# Altium project BTM_MAIN_UNIT.PrjPcb (part 1 of 3)
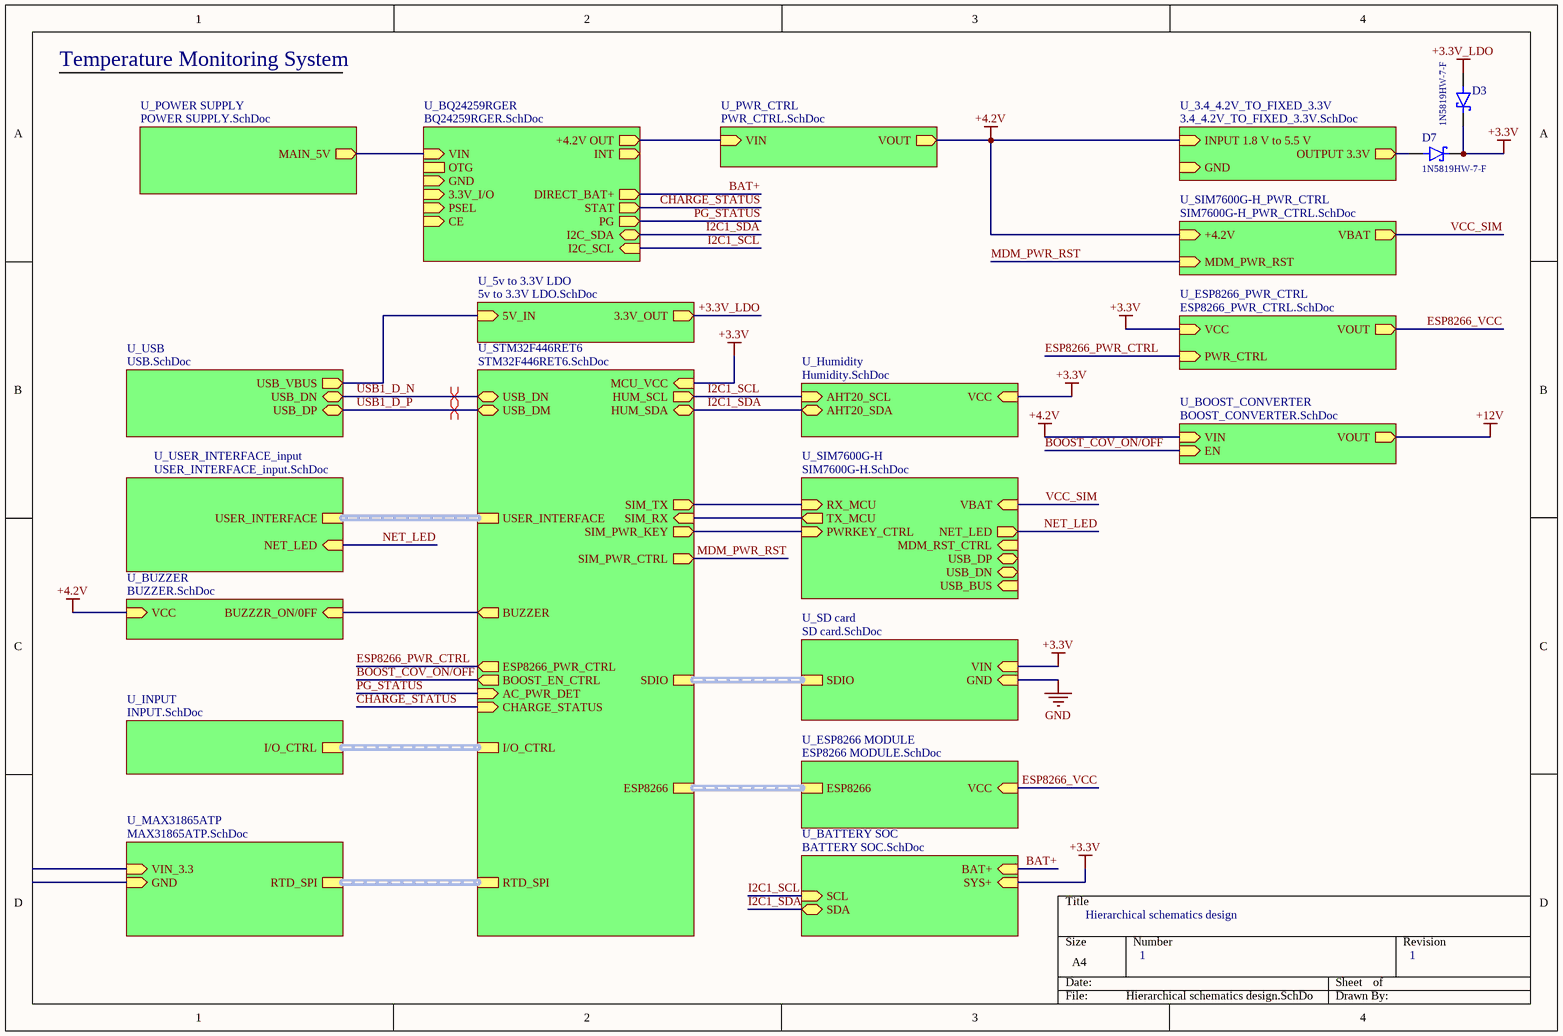
[diagram p0: Hierarchical schematics design.SchDoc]
30 sheets, 296 parts. Net scope: hierarchical (ports join the sheet entries above them; power ports are global).
Board file: PCB1.PcbDoc
Sheets:
  Hierarchical schematics design.SchDoc
    U_MAX31865ATP = MAX31865ATP.SchDoc
    U_PWR_CTRL = PWR_CTRL.SchDoc
    U_BQ24259RGER = BQ24259RGER.SchDoc
    U_SD card = SD card.SchDoc
    U_POWER SUPPLY = POWER SUPPLY.SchDoc
    U_INPUT = INPUT.SchDoc
    U_STM32F446RET6 = STM32F446RET6.SchDoc
    U_USB = USB.SchDoc
    U_3.4_4.2V_TO_FIXED_3.3V = 3.4_4.2V_TO_FIXED_3.3V.SchDoc
    U_SIM7600G-H = SIM7600G-H.SchDoc
      U_SIM_INTERFACE = SIM_INTERFACE.SchDoc
    U_BUZZER = BUZZER.SchDoc
    U_ESP8266 MODULE = ESP8266 MODULE.SchDoc
    U_Humidity = Humidity.SchDoc
    U_USER_INTERFACE_input = USER_INTERFACE_input.SchDoc
    U_SIM7600G-H_PWR_CTRL = SIM7600G-H_PWR_CTRL.SchDoc
    U_BATTERY SOC = BATTERY SOC.SchDoc
    U_ESP8266_PWR_CTRL = ESP8266_PWR_CTRL.SchDoc
    U_BOOST_CONVERTER = BOOST_CONVERTER.SchDoc
    U_5v to 3.3V LDO = 5v to 3.3V LDO.SchDoc
  FLASH MEMORY.SchDoc
  ETHERNET_W5500.SchDoc
  ETHERNET_STM32.SchDoc
  RS485.SchDoc
  OUTPUT.SchDoc
  SIM7600G-H_USB.SchDoc
  NRF52.SchDoc
  12V_TO_5V_DC.SchDoc
  Display_PWR_CTRL.SchDoc

## Sheet Hierarchical schematics design.SchDoc: Hierarchical schematics design
size A4; Revision: 1; SheetNumber: 1; SheetTotal: 31

### Parts
D3  1N5819HW-7-F  [SOD3715X145N]
D7  1N5819HW-7-F  [SOD3715X145N]

### Sub-sheets
U_3.4_4.2V_TO_FIXED_3.3V = 3.4_4.2V_TO_FIXED_3.3V.SchDoc: INPUT 1.8 V to 5.5 V (in), OUTPUT 3.3V (out), GND (in)
U_5v to 3.3V LDO = 5v to 3.3V LDO.SchDoc: 5V_IN (in), 3.3V_OUT (out)
U_BATTERY SOC = BATTERY SOC.SchDoc: BAT+ (in), SYS+ (in), SCL (in), SDA (bidir)
U_BOOST_CONVERTER = BOOST_CONVERTER.SchDoc: VIN (in), EN (in), VOUT (out)
U_BQ24259RGER = BQ24259RGER.SchDoc: +4.2V OUT (out), I2C_SCL (in), I2C_SDA (bidir), INT (out), OTG, CE (in), GND (in), 3.3V_I/O (in), VIN (in), PSEL (in), STAT (out), PG (out), DIRECT_BAT+ (out)
U_BUZZER = BUZZER.SchDoc: BUZZZR_ON/0FF (in), VCC (in)
U_ESP8266 MODULE = ESP8266 MODULE.SchDoc: ESP8266 (harness ESP8266), VCC (in)
U_ESP8266_PWR_CTRL = ESP8266_PWR_CTRL.SchDoc: PWR_CTRL (in), VCC (in), VOUT (out)
U_Humidity = Humidity.SchDoc: AHT20_SCL (in), AHT20_SDA (bidir), VCC (in)
U_INPUT = INPUT.SchDoc: I/O_CTRL (harness I/O)
U_MAX31865ATP = MAX31865ATP.SchDoc: RTD_SPI (harness RTD_SENSOR), VIN_3.3 (in), GND (in)
U_POWER SUPPLY = POWER SUPPLY.SchDoc: MAIN_5V (out)
U_PWR_CTRL = PWR_CTRL.SchDoc: VIN (in), VOUT (out)
U_SD card = SD card.SchDoc: SDIO (harness SD_CARD), VIN (in), GND (in)
U_SIM7600G-H = SIM7600G-H.SchDoc: TX_MCU (out), RX_MCU (in), USB_BUS (in), USB_DP (bidir), USB_DN (bidir), VBAT (in), PWRKEY_CTRL (in), MDM_RST_CTRL (in), NET_LED (out)
U_SIM7600G-H_PWR_CTRL = SIM7600G-H_PWR_CTRL.SchDoc: MDM_PWR_RST (in), +4.2V (in), VBAT (out)
U_STM32F446RET6 = STM32F446RET6.SchDoc: RTD_SPI (harness RTD_SENSOR), SDIO (harness SD_CARD), ESP8266 (harness ESP8266), SIM_TX (out), SIM_RX (in), SIM_PWR_KEY (out), HUM_SCL (out), HUM_SDA (bidir), USB_DN (bidir), USB_DM (bidir), USER_INTERFACE (harness *), MCU_VCC (in), ESP8266_PWR_CTRL (out), BUZZER (out), I/O_CTRL (harness I/O), AC_PWR_DET (in), CHARGE_STATUS (in), SIM_PWR_CTRL (out), BOOST_EN_CTRL (out)
U_USB = USB.SchDoc: USB_VBUS (out), USB_DN (bidir), USB_DP (bidir)
U_USER_INTERFACE_input = USER_INTERFACE_input.SchDoc: USER_INTERFACE (harness *), NET_LED (in)

### Nets
+3.3V: D3.C(K) D7.C(K) ; sheet U_MAX31865ATP/VIN_3.3, sheet U_BQ24259RGER/3.3V_I/O, sheet U_SD card/VIN, sheet U_STM32F446RET6/MCU_VCC, sheet U_Humidity/VCC, sheet U_BATTERY SOC/SYS+, sheet U_ESP8266_PWR_CTRL/VCC
+3.3V_LDO: D3.A ; sheet U_5v to 3.3V LDO/3.3V_OUT
+4.2V: sheet U_PWR_CTRL/VOUT, sheet U_3.4_4.2V_TO_FIXED_3.3V/INPUT 1.8 V to 5.5 V, sheet U_BUZZER/VCC, sheet U_SIM7600G-H_PWR_CTRL/+4.2V, sheet U_BOOST_CONVERTER/VIN
BAT: sheet U_PWR_CTRL/VIN, sheet U_BQ24259RGER/+4.2V OUT
GND: sheet U_MAX31865ATP/GND, sheet U_BQ24259RGER/GND, sheet U_SD card/GND, sheet U_3.4_4.2V_TO_FIXED_3.3V/GND
VBUS2: sheet U_BQ24259RGER/VIN, sheet U_POWER SUPPLY/MAIN_5V
VCC_SIM: sheet U_SIM7600G-H/VBAT, sheet U_SIM7600G-H_PWR_CTRL/VBAT  [project net VBAT]
VUSB: sheet U_USB/USB_VBUS, sheet U_5v to 3.3V LDO/5V_IN
BAT+: sheet U_BQ24259RGER/DIRECT_BAT+, sheet U_BATTERY SOC/BAT+
BOOST_COV_ON/OFF: sheet U_STM32F446RET6/BOOST_EN_CTRL, sheet U_BOOST_CONVERTER/EN
BUZZER: sheet U_STM32F446RET6/BUZZER, sheet U_BUZZER/BUZZZR_ON/0FF
CHARGE_STATUS: sheet U_BQ24259RGER/STAT, sheet U_STM32F446RET6/CHARGE_STATUS
ESP8266_PWR_CTRL: sheet U_STM32F446RET6/ESP8266_PWR_CTRL, sheet U_ESP8266_PWR_CTRL/PWR_CTRL
ESP8266_VCC: sheet U_ESP8266 MODULE/VCC, sheet U_ESP8266_PWR_CTRL/VOUT
I2C1_SCL: sheet U_BQ24259RGER/I2C_SCL, sheet U_STM32F446RET6/HUM_SCL, sheet U_Humidity/AHT20_SCL, sheet U_BATTERY SOC/SCL
I2C1_SDA: sheet U_BQ24259RGER/I2C_SDA, sheet U_STM32F446RET6/HUM_SDA, sheet U_Humidity/AHT20_SDA, sheet U_BATTERY SOC/SDA
MDM_PWR_RST: sheet U_STM32F446RET6/SIM_PWR_CTRL, sheet U_SIM7600G-H_PWR_CTRL/MDM_PWR_RST
NET_LED: sheet U_SIM7600G-H/NET_LED, sheet U_USER_INTERFACE_input/NET_LED
PG_STATUS: sheet U_BQ24259RGER/PG, sheet U_STM32F446RET6/AC_PWR_DET
USB1_D_N: sheet U_STM32F446RET6/USB_DN, sheet U_USB/USB_DN
USB1_D_P: sheet U_STM32F446RET6/USB_DM, sheet U_USB/USB_DP
NetC34_2: D7.A ; sheet U_3.4_4.2V_TO_FIXED_3.3V/OUTPUT 3.3V
NetR86_1: sheet U_STM32F446RET6/SIM_PWR_KEY, sheet U_SIM7600G-H/PWRKEY_CTRL
NetU20_42: sheet U_STM32F446RET6/SIM_TX, sheet U_SIM7600G-H/RX_MCU
NetU20_43: sheet U_STM32F446RET6/SIM_RX, sheet U_SIM7600G-H/TX_MCU

### Buses and harness runs
harness sheet U_ESP8266 MODULE/ESP8266 = sheet U_STM32F446RET6/ESP8266
harness sheet U_INPUT/I/O_CTRL = sheet U_STM32F446RET6/I/O_CTRL
harness sheet U_MAX31865ATP/RTD_SPI = sheet U_STM32F446RET6/RTD_SPI
harness sheet U_SD card/SDIO = sheet U_STM32F446RET6/SDIO
harness sheet U_STM32F446RET6/USER_INTERFACE = sheet U_USER_INTERFACE_input/USER_INTERFACE

### Layout directives
differential pair; net class USB: USB1_D_N, USB1_D_P

### Notes on the sheet
- Temperature Monitoring System

### Library data of the parts
D3 D7 = 1N5819HW-7-F: Diode Schottky 40 V 1A Surface Mount SOD-123; MF: Diodes Inc.; Value: *; SnapEDA_Link: https://www.snapeda.com/parts/1N5819HW-7-F/Diodes+Inc./view-part/?ref=snap; Purchase-URL: https://pricing.snapeda.com/search/part/1N5819HW-7-F/?ref=eda; Availability: In Stock; Price: None; Package: SOD-123 Fairchild Semiconductor; Check_prices: https://www.snapeda.com/parts/1N5819HW-7-F/Diodes+Inc./view-part/?ref=eda; MP: 1N5819HW-7-F

## Sheet MAX31865ATP.SchDoc
size A4; SheetNumber: 9; SheetTotal: 31
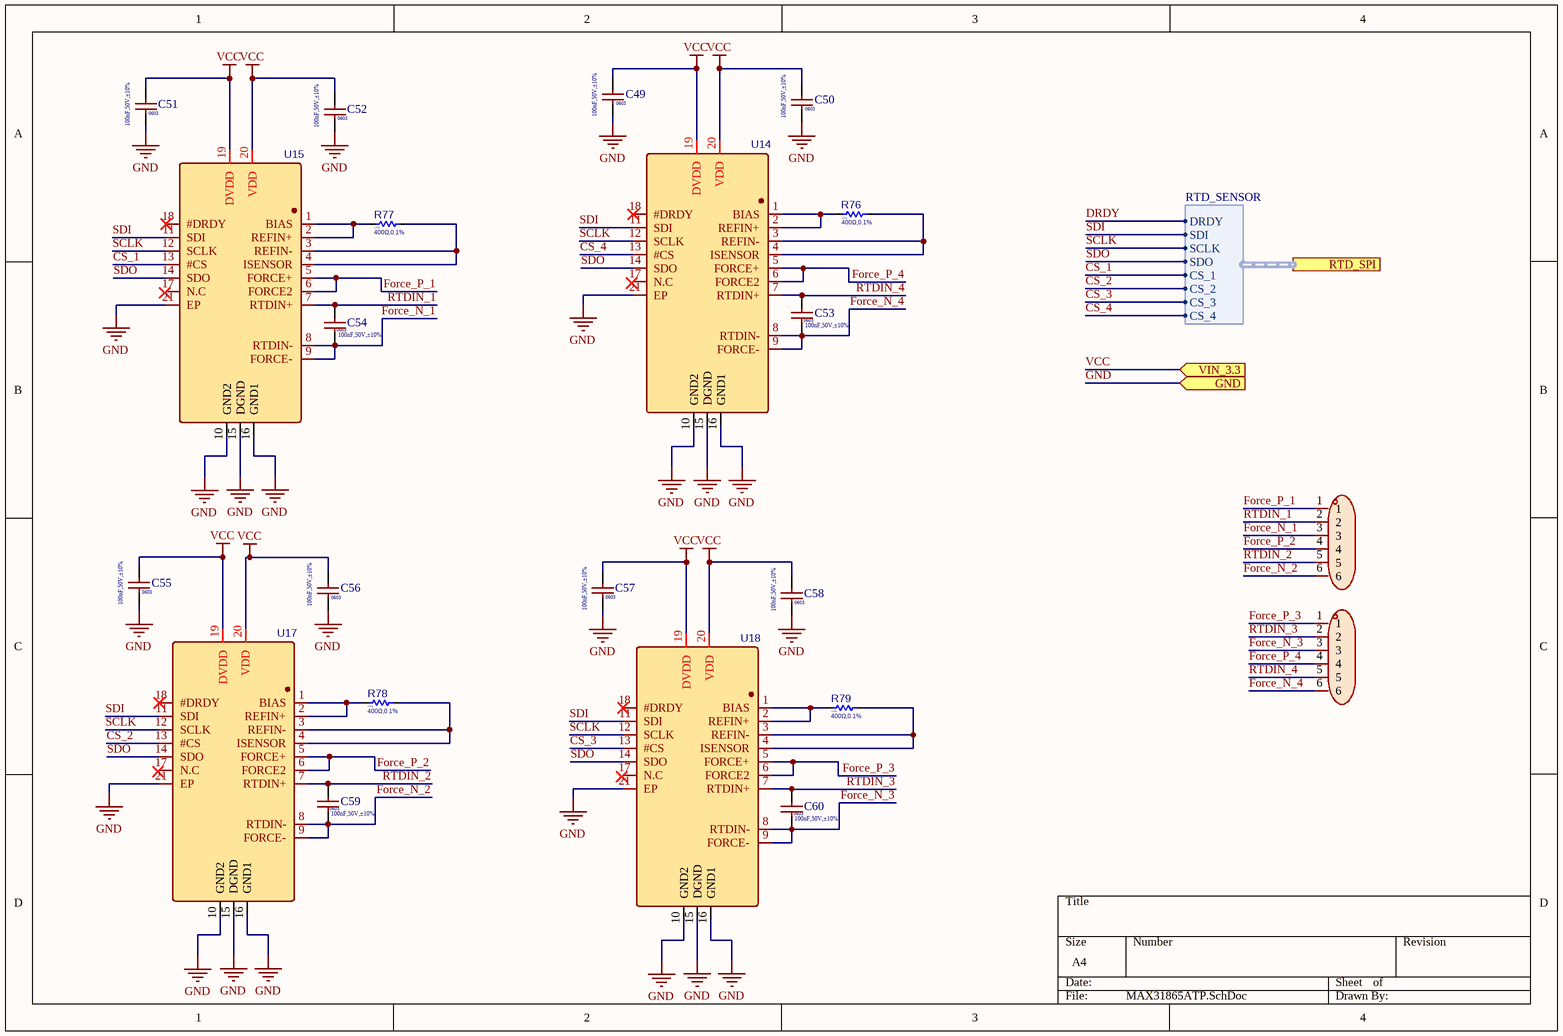
[diagram p1: MAX31865ATP.SchDoc]

### Parts
C49  value 100nF,50V,±10%  Package: 0603  [C0603]  (hidden comment: CL10B104KB8NNNC)
C50  value 100nF,50V,±10%  Package: 0603  [C0603]  (hidden comment: CL10B104KB8NNNC)
C51  value 100nF,50V,±10%  Package: 0603  [C0603]  (hidden comment: CL10B104KB8NNNC)
C52  value 100nF,50V,±10%  Package: 0603  [C0603]  (hidden comment: CL10B104KB8NNNC)
C53  value 100nF,50V,±10%  Package: 0603  [C0603]  (hidden comment: CL10B104KB8NNNC)
C54  value 100nF,50V,±10%  Package: 0603  [C0603]  (hidden comment: CL10B104KB8NNNC)
C55  value 100nF,50V,±10%  Package: 0603  [C0603]  (hidden comment: CL10B104KB8NNNC)
C56  value 100nF,50V,±10%  Package: 0603  [C0603]  (hidden comment: CL10B104KB8NNNC)
C57  value 100nF,50V,±10%  Package: 0603  [C0603]  (hidden comment: CL10B104KB8NNNC)
C58  value 100nF,50V,±10%  Package: 0603  [C0603]  (hidden comment: CL10B104KB8NNNC)
C59  value 100nF,50V,±10%  Package: 0603  [C0603]  (hidden comment: CL10B104KB8NNNC)
C60  value 100nF,50V,±10%  Package: 0603  [C0603]  (hidden comment: CL10B104KB8NNNC)
R76  value 400Ω,0.1%  Package: 1206  [R1206]  (hidden comment: 400Ω)
R77  value 400Ω,0.1%  Package: 1206  [R1206]  (hidden comment: 400Ω)
R78  value 400Ω,0.1%  Package: 1206  [R1206]  (hidden comment: 400Ω)
R79  value 400Ω,0.1%  Package: 1206  [R1206]  (hidden comment: 400Ω)
U14  MAX31865ATP+T  [QFN-20-EP(5x5)]  (value not drawn)
U15  MAX31865ATP+T  [QFN-20-EP(5x5)]  (value not drawn)
U16  DBT50G-6.35-6P-BK-P OGC  [6P_P=6.35mm]  (value not drawn)
U17  MAX31865ATP+T  [QFN-20-EP(5x5)]  (value not drawn)
U18  MAX31865ATP+T  [QFN-20-EP(5x5)]  (value not drawn)
U19  DBT50G-6.35-6P-BK-P OGC  [6P_P=6.35mm]  (value not drawn)

### Ports
GND (in), RTD_SPI (harness RTD_SENSOR), VIN_3.3 (in)

### Harnesses
RTD_SENSOR: DRDY, SDI, SCLK, CS_1, CS_2, CS_3, CS_4, SDO

### Nets
GND: C49.1 C50.1 C51.1 C52.1 C55.1 C56.1 C57.1 C58.1 U14.10(GND2) U14.15(DGND) U14.16(GND1) U14.21(EP) U15.10(GND2) U15.15(DGND) U15.16(GND1) U15.21(EP) U17.10(GND2) U17.15(DGND) U17.16(GND1) U17.21(EP) U18.10(GND2) U18.15(DGND) U18.16(GND1) U18.21(EP) ; port GND
VCC: C49.2 C50.2 C51.2 C52.2 C55.2 C56.2 C57.2 C58.2 U14.19(DVDD) U14.20(VDD) U15.19(DVDD) U15.20(VDD) U17.19(DVDD) U17.20(VDD) U18.19(DVDD) U18.20(VDD) ; port VIN_3.3  [project net +3.3V]
CS_1: U15.13(#CS) ; port RTD_SPI.CS_1
CS_2: U17.13(#CS) ; port RTD_SPI.CS_2
CS_3: U18.13(#CS) ; port RTD_SPI.CS_3
CS_4: U14.13(#CS) ; port RTD_SPI.CS_4
DRDY: port RTD_SPI.DRDY
Force_N_1: C54.2 U15.8(RTDIN-) U15.9(FORCE-) U16.3
Force_N_2: C59.2 U16.6 U17.8(RTDIN-) U17.9(FORCE-)
Force_N_3: C60.2 U18.8(RTDIN-) U18.9(FORCE-) U19.3
Force_N_4: C53.2 U14.8(RTDIN-) U14.9(FORCE-) U19.6
Force_P_1: U15.5(FORCE+) U15.6(FORCE2) U16.1
Force_P_2: U16.4 U17.5(FORCE+) U17.6(FORCE2)
Force_P_3: U18.5(FORCE+) U18.6(FORCE2) U19.1
Force_P_4: U14.5(FORCE+) U14.6(FORCE2) U19.4
RTDIN_1: C54.1 U15.7(RTDIN+) U16.2
RTDIN_2: C59.1 U16.5 U17.7(RTDIN+)
RTDIN_3: C60.1 U18.7(RTDIN+) U19.2
RTDIN_4: C53.1 U14.7(RTDIN+) U19.5
SCLK: U14.12(SCLK) U15.12(SCLK) U17.12(SCLK) U18.12(SCLK) ; port RTD_SPI.SCLK  [project net RTD_CLK1]
SDI: U14.11(SDI) U15.11(SDI) U17.11(SDI) U18.11(SDI) ; port RTD_SPI.SDI  [project net RTD_MOSI1]
SDO: U14.14(SDO) U15.14(SDO) U17.14(SDO) U18.14(SDO) ; port RTD_SPI.SDO  [project net RTD_MISO1]
NetR76_1: R76.1 U14.3(REFIN-) U14.4(ISENSOR)
NetR76_2: R76.2 U14.1(BIAS) U14.2(REFIN+)
NetR77_1: R77.1 U15.3(REFIN-) U15.4(ISENSOR)
NetR77_2: R77.2 U15.1(BIAS) U15.2(REFIN+)
NetR78_1: R78.1 U17.3(REFIN-) U17.4(ISENSOR)
NetR78_2: R78.2 U17.1(BIAS) U17.2(REFIN+)
NetR79_1: R79.1 U18.3(REFIN-) U18.4(ISENSOR)
NetR79_2: R79.2 U18.1(BIAS) U18.2(REFIN+)

Not connected (* = marked no-connect by the designer): U14 17(N.C) 18(#DRDY)*; U15 17(N.C) 18(#DRDY)*; U17 17(N.C) 18(#DRDY)*; U18 17(N.C) 18(#DRDY)*

### Library data of the parts
C49-C60 = CL10B104KB8NNNC: 50V 100nF X7R ±10% 0603 Multilayer Ceramic Capacitors MLCC - SMD/SMT ROHS; Manufacturer: SAMSUNG; Max Operating Temp: 125; Min Operating Temp: -55; MPN: CL10B104KB8NNNC; Datasheet: https://datasheet.lcsc.com/lcsc/2304140030_Samsung-Electro-Mechanics-CL10B104KB8NNNC_C1591.pdf; LCSC: C1591
R76-R79 = RT1206BRD07400RL: 250mW Thin Film Resistor 200V ±25ppm/℃ ±0.1% 400Ω 1206 Chip Resistor - Surface Mount ROHS; Manufacturer: YAGEO; Max Operating Temp: +155; Datasheet: https://www.lcsc.com/datasheet/lcsc_datasheet_2010201834_YAGEO-RT1206BRD07400RL_C706413.pdf; MPN: RT1206BRD07400RL; Min Operating Temp: -55; LCSC: C706413
U14 U15 U17 U18 = MAX31865ATP+T: QFN-20-EP(5x5) Analog to Digital Converters (ADC) ROHS; Manufacturer: ADI/MAXIM; LCSC: C118474; MPN: MAX31865ATP+T; Datasheet: *https://www.lcsc.com/datasheet/lcsc_datasheet_2304140030_Analog-Devices-Inc--Maxim-Integrated-MAX31865ATP-T_C118474.pdf; Package: QFN-20-EP(5x5)
U16 U19 = DBT50G-6.35-6P-BK-P OGC: 10A -40℃~+105℃ 300V Black 1x6P Corner Tri-face 22~16 6 1 6.35mm Plugin,P=6.35mm Barrier Terminal Blocks ROHS; Manufacturer: DORABO(地博电气); Supplier Part: C5179475; Manufacturer Part: DBT50G-6.35-6P-BK-P OGC; Supplier Footprint: 插件,P=6.35mm; Datasheet: https://atta.szlcsc.com/upload/public/pdf/source/20230321/4A82F27AE8A2F5607DB8D935518A4E7A.pdf; Operating Temperature Range: -40℃~+105℃

## Sheet PWR_CTRL.SchDoc
size A; SheetNumber: 8; SheetTotal: 28
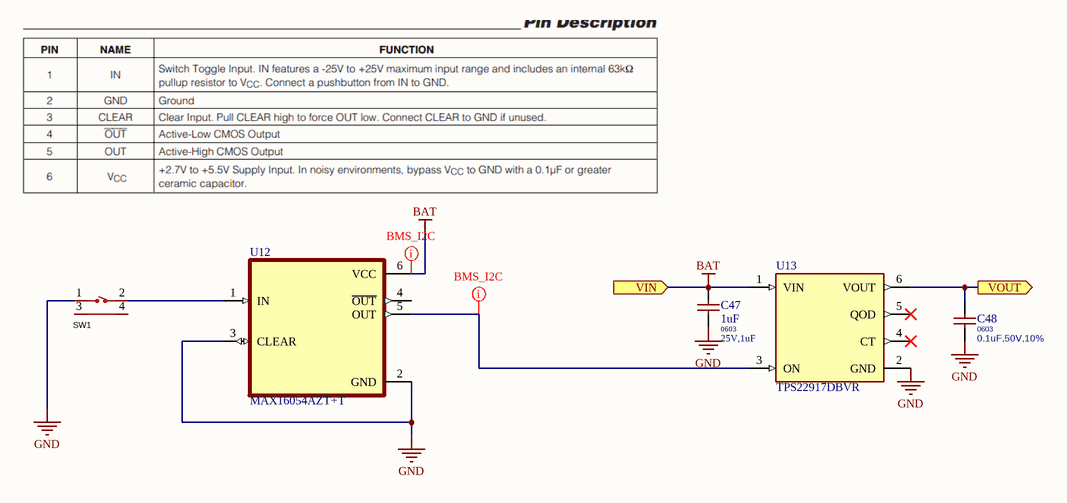
[diagram p2: PWR_CTRL.SchDoc]

### Parts
C47  1uF  value 25V,1uF  Package: 0603  [CAPC1608X90N]
C48  Package: 0603  [C0603]  (hidden comment: 0.1uF,50V,10%)
SW1  (no value)  [SW-TH_4P-L7.5-W8.0-P4.50]
U12  MAX16054AZT+T  [SOT95P275X110-6N]
U13  TPS22917DBVR  [SOT95P280X145-6N]

### Ports
VIN (in), VOUT (out)

### Nets
+4.2V: C48.2 U13.6(VOUT) ; port VOUT
BAT: C47.2 U12.6(VCC) U13.1(VIN) ; port VIN
GND: C47.1 C48.1 SW1.1 U12.2(GND) U12.3(CLEAR) U13.2(GND)
NetSW1_2: SW1.2 U12.1(IN)
NetU12_5: U12.5(OUT) U13.3(ON)

Not connected (* = marked no-connect by the designer): SW1 3 4; U12 4(~{OUT}); U13 4(CT)* 5(QOD)*

### Layout directives
net class BMS_I2C: BAT, NetU12_5

### Library data of the parts
C47 = 0603B105K250NT: 25V 1uF X7R ±10% 0603 Multilayer Ceramic Capacitors MLCC - SMD/SMT ROHS; Manufacturer: FH (Guangdong Fenghua Advanced Tech); LCSC: C59302; Datasheet: https://datasheet.lcsc.com/lcsc/2304140030_FH--Guangdong-Fenghua-Advanced-Tech-0603B105K250NT_C59302.pdf; MPN: 0603B105K250NT
C48 = GCM188R71H104KA57J: CAP CER 0.1UF 50V X7R 0603; Manufacturer: Murata Electronics; Type: SM; Min Operating Temp: -55°C; Max Operating Temp: 125°C; MPN: GCM188R71H104KA57J; Datasheet: https://datasheet.lcsc.com/lcsc/2404081050_Murata-Electronics-GCM188R71H104KA57J_C3011652.pdf; LCSC: C3011652; Value: 0.1uF,50V,10%
SW1 = TC-6615-8-260G: None With bracket 50mA 6mm 100000 Times 260gf 12V 6mm 8mm Round Button Bend-in SPST Plugin Tactile Switches ROHS; Manufacturer: HCTL; LCSC: C2845277; MPN: TC-6615-8-260G; Package: L6*H8; Datasheet: https://atta.szlcsc.com/upload/public/pdf/source/20230523/3B07ECEFF69432C539FEAF1B55455C52.pdf; Switch Length: 6mm; Switch Height: 8mm; Operating Temperature: -25℃~+85℃
U12 = MAX16054AZT+T: On/Off Controller with Debounce and Â±15kV ESD Protection; MF: Analog Devices; Check_prices: https://www.snapeda.com/parts/MAX16054AZT+T/Analog+Devices/view-part/?ref=eda; Package: SOT-23-6 Maxim; Availability: In Stock; Value: *; Purchase-URL: https://pricing.snapeda.com/search/part/MAX16054AZT+T/?ref=eda; MP: MAX16054AZT+T; SnapEDA_Link: https://www.snapeda.com/parts/MAX16054AZT+T/Analog+Devices/view-part/?ref=snap; Price: None
U13 = TPS22917DBVR: 5.5-V, 2-A, 80-mÎ© , 10-nA leakage load switch adj. rise time and adj output discharge; MF: Texas Instruments; SnapEDA_Link: https://www.snapeda.com/parts/TPS22917DBVR/Texas+Instruments/view-part/?ref=snap; Package: SOT-23-6 Texas Instruments; Value: *; MP: TPS22917DBVR; Check_prices: https://www.snapeda.com/parts/TPS22917DBVR/Texas+Instruments/view-part/?ref=eda

## Sheet BQ24259RGER.SchDoc
size A; SheetNumber: 7; SheetTotal: 30
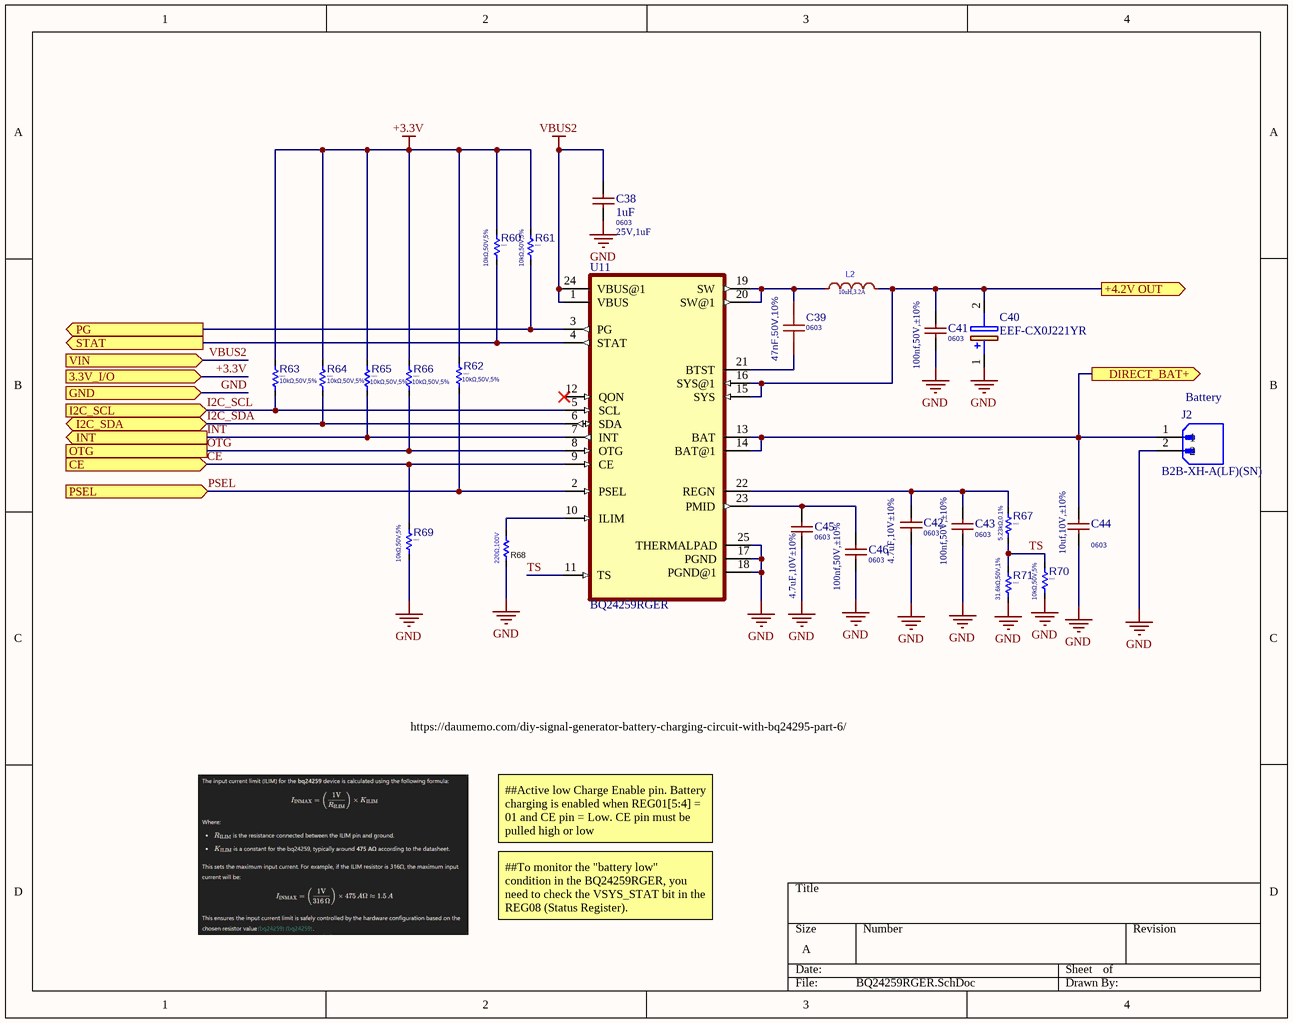
[diagram p3: BQ24259RGER.SchDoc]

### Parts
C38  1uF  value 25V,1uF  Package: 0603  [CAPC1608X90N]
C39  value 47nF,50V,10%  Package: 0603  [C0603]  (hidden comment: 47nF)
C40  EEF-CX0J221YR  [CAPPM7343X200N]
C41  value 100nf,50V,±10%  Package: 0603  [C0603]  (hidden comment: CC0603KRX7R9BB104)
C42  value 4.7uF,10V±10%  Package: 0603  [C0603]  (hidden comment: 4.7uf)
C43  value 100nf,50V,±10%  Package: 0603  [C0603]  (hidden comment: CC0603KRX7R9BB104)
C44  Package: 0603  [C0603]  (hidden comment: 10uf,10V,±10%)
C45  value 4.7uF,10V±10%  Package: 0603  [C0603]  (hidden comment: 4.7uf)
C46  value 100nf,50V,±10%  Package: 0603  [C0603]  (hidden comment: CC0603KRX7R9BB104)
J2  B2B-XH-A(LF)(SN)  [JST_B2B-XH-A(LF)(SN)]
L2  value 10uH,3.2A  [inductor_SMD,5.2x5.4mm]  (hidden comment: 10uH)
R60  value 10kΩ,50V,5%  Package: 0402  [R0402]  (hidden comment: 10kΩ)
R61  value 10kΩ,50V,5%  Package: 0402  [R0402]  (hidden comment: 10kΩ)
R62  value 10kΩ,50V,5%  Package: 0402  [R0402]  (hidden comment: 10kΩ)
R63  value 10kΩ,50V,5%  Package: 0402  [R0402]  (hidden comment: 10kΩ)
R64  value 10kΩ,50V,5%  Package: 0402  [R0402]  (hidden comment: 10kΩ)
R65  value 10kΩ,50V,5%  Package: 0402  [R0402]  (hidden comment: 10kΩ)
R66  value 10kΩ,50V,5%  Package: 0402  [R0402]  (hidden comment: 10kΩ)
R67  value 5.23kΩ,0.1%  Package: 0402  [R0402]  (hidden comment: 5.23kΩ)
R68  value 220Ω,100V  [R0402]  (hidden comment: 220Ω)
R69  value 10kΩ,50V,5%  Package: 0402  [R0402]  (hidden comment: 10kΩ)
R70  value 10kΩ,50V,5%  Package: 0402  [R0402]  (hidden comment: 10kΩ)
R71  value 31.6kΩ,50V,1%  Package: 0402  [R0402]  (hidden comment: 31.6kΩ)
U11  BQ24259RGER  [QFN50P400X400X100-25N]

### Ports
3.3V_I/O (in), +4.2V OUT (out), CE (in), DIRECT_BAT+ (out), GND (in), I2C_SCL (in), I2C_SDA (bidir), INT (out), OTG, PG (out), PSEL (in), STAT (out), VIN (in)

### Nets
+3.3V: R60.2 R61.2 R62.2 R63.2 R64.2 R65.2 R66.2 ; port 3.3V_I/O
BAT: C40.2(-) C41.2 L2.2 U11.15(SYS) U11.16(SYS@1) ; port +4.2V OUT
GND: C38.1 C40.1(+) C41.1 C42.1 C43.1 C44.1 C45.1 C46.1 J2.2 R68.1 R69.1 R70.1 R71.1 U11.17(PGND) U11.18(PGND@1) U11.25(THERMALPAD) ; port GND
VBUS2: C38.2 U11.1(VBUS) U11.24(VBUS@1) ; port VIN
BAT+: C44.2 J2.1 U11.13(BAT) U11.14(BAT@1) ; port DIRECT_BAT+
CE: R69.2 U11.9(CE) ; port CE
CHARGE_STATUS: R60.1 U11.4(STAT) ; port STAT
I2C_SCL: R63.1 U11.5(SCL) ; port I2C_SCL  [project net I2C1_SCL]
I2C_SDA: R64.1 U11.6(SDA) ; port I2C_SDA  [project net I2C1_SDA]
INT: R65.1 U11.7(INT) ; port INT
OTG: R66.1 U11.8(OTG) ; port OTG
PG_STATUS: R61.1 U11.3(PG) ; port PG
PSEL: R62.1 U11.2(PSEL) ; port PSEL
TS: R67.1 R70.2 R71.2 U11.11(TS)
NetC39_1: C39.1 U11.21(BTST)
NetC39_2: C39.2 L2.1 U11.19(SW) U11.20(SW@1)
NetC42_2: C42.2 C43.2 R67.2 U11.22(REGN)
NetC45_2: C45.2 C46.2 U11.23(PMID)
NetR68_2: R68.2 U11.10(ILIM)

Not connected (* = marked no-connect by the designer): U11 12(QON)*

### Notes on the sheet
- (near J2) Battery
- https://daumemo.com/diy-signal-generator-battery-charging-circuit-with-bq24295-part-6/
- ##Active low Charge Enable pin. Battery charging is enabled when REG01[5:4] = 01 and CE pin = Low. CE pin must be pulled high or low
- ##To monitor the "battery low" condition in the BQ24259RGER, you need to check the VSYS_STAT bit in the REG08 (Status Register).

### Library data of the parts
C38 = 0603B105K250NT: as C47 on sheet PWR_CTRL; LCSC: C59302; Datasheet: https://datasheet.lcsc.com/lcsc/2304140030_FH--Guangdong-Fenghua-Advanced-Tech-0603B105K250NT_C59302.pdf; MPN: 0603B105K250NT
C39 = CL10B473KB8NNNC: 50V 47nF X7R ±10% 0603 Multilayer Ceramic Capacitors MLCC - SMD/SMT ROHS; Manufacturer: SAMSUNG; Type: *; MPN: CL10B473KB8NNNC; Max Operating Temp: +85; Min Operating Temp: -55; Datasheet: https://www.lcsc.com/datasheet/lcsc_datasheet_2304140030_Samsung-Electro-Mechanics-CL10B473KB8NNNC_C1622.pdf; LCSC: C1622
C40 = EEF-CX0J221YR: Capacitor Polarised; Manufacturer_Name: Panasonic; Datasheet Link: https://datasheet.lcsc.com/szlcsc/PANASONIC-EEFCX0J221YR_C141444.pdf; Height: 2mm; Manufacturer_Part_Number: EEF-CX0J221YR; Mouser Part Number: N/A; Mouser Price/Stock: https://www.mouser.com/Search/Refine.aspx?Keyword=N%2FA
C41 C43 C46 = CC0603KRX7R9BB104: 50V 100nF X7R ±10% 0603 Multilayer Ceramic Capacitors MLCC - SMD/SMT ROHS; MPN: 603-CC603KRX7R9BB104; Manufacturer: KEMET; Max Operating Temp: 35 °C; Min Operating Temp: 15 °C; Datasheet: http://componentsearchengine.com/Datasheets/3/CC0603KRX7R9BB104.pdf; LCSC: C14663
C42 C45 = 0603B475K100NT: 10V 4.7uF X7R ±10% 0603 Multilayer Ceramic Capacitors MLCC - SMD/SMT ROHS; MPN: CL10A475KQ8NNNC; Manufacturer: Samsung Electro-Mechanics; Datasheet: https://lcsc.componentsearchengine.com/Datasheets/2/CL10A475KQ8NNNC.pdf
C44 = GRM188Z71A106KA73D: 10V 10uF X7R ±10% 0603 Multilayer Ceramic Capacitors MLCC - SMD/SMT ROHS; MPN: 603-CC603KRX7R9BB104; Manufacturer: KEMET; Max Operating Temp: 125 ℃; Min Operating Temp: -55 ℃; Datasheet: http://componentsearchengine.com/Datasheets/3/CC0603KRX7R9BB104.pdf; LCSC: C2959727; Value: 10uf,10V,±10%
J2 = B2B-XH-A(LF)(SN): Connector Header Through Hole 2 position 0.098 (2.50mm); Manufacturer: JST Sales America Inc.; Value: *; Package: None; MPN: B2B-XH-A(LF)(SN); Datasheet: https://datasheet.lcsc.com/lcsc/2304140030_JST-B2B-XH-A-LF-SN_C158012.pdf; LCSC: C158012
L2 = FXL0530-100-M: 3.2A 10uH Integrated molded inductor ±20% 3.5A SMD,5.2x5.4mm Power Inductors ROHS; Manufacturer: cjiang; LCSC: C177248; MPN: FXL0530-100-M; Package: SMD,5.2x5.4mm; Datasheet: https://atta.szlcsc.com/upload/public/pdf/source/20240426/3189EA8206330E2108542F9E34E540E7.pdf
R60-R66 R69 R70 = RC0402JR-0710KL: 62.5mW Thick Film Resistors 50V ±100ppm/℃ ±5% 10kΩ 0402 Chip Resistor - Surface Mount ROHS; Manufacturer: YAGEO; MPN: RC0402JR-0710KL; Max Operating Temp: +155; Min Operating Temp: -55; Datasheet: https://datasheet.lcsc.com/lcsc/1810241334_YAGEO-RC0402JR-0710KL_C60489.pdf; LCSC: C60489
R67 = RT0402BRD075K23L: 63mW Thin Film Resistor ±25ppm/℃ ±0.1% 5.23kΩ 0402 Chip Resistor - Surface Mount ROHS; Manufacturer: YAGEO; Max Operating Temp: +155; Type: *; Datasheet: https://www.lcsc.com/datasheet/lcsc_datasheet_2311211102_YAGEO-RT0402BRD075K23L_C852857.pdf; MPN: RT0402BRD075K23L; Min Operating Temp: -55; LCSC: C852857
R68 = ERJ2RKF2200X: 100mW Thick Film Resistors 100V ±100ppm/℃ ±1% 220Ω 0402 Chip Resistor - Surface Mount ROHS; Manufacturer: PANASONIC; CSC: C413071; MPN: ERJ2RKF2200X; Package: 0402; Datasheet: https://atta.szlcsc.com/upload/public/pdf/source/20190820/C413071_63A430A85C947944E14EACAA56F7187B.pdf; Operating Temperature Range: -55℃~+155℃
R71 = RC0402FR-0731K6L: 62.5mW Thick Film Resistors 50V ±100ppm/℃ ±1% 31.6kΩ 0402 Chip Resistor - Surface Mount ROHS; Manufacturer: YAGEO; Type: *; MPN: RC0402FR-0731K6L; Max Operating Temp: +155; Min Operating Temp: -55
U11 = BQ24259RGER: I2C controlled 2A single cell USB NVDC-1 charger with adjustable voltageUSB OTG; MF: Texas Instruments; Value: *; SnapEDA_Link: https://www.snapeda.com/parts/BQ24259RGER/Texas+Instruments/view-part/?ref=snap; MP: BQ24259RGER; Package: VQFN-24 Texas Instruments; Check_prices: https://www.snapeda.com/parts/BQ24259RGER/Texas+Instruments/view-part/?ref=eda; Digi-Key_Part_Number: 296-43322-2-ND; Purchase-URL: https://pricing.snapeda.com/search/part/BQ24259RGER/?ref=eda

## Sheet SD card.SchDoc
size A; SheetNumber: 2; SheetTotal: 31
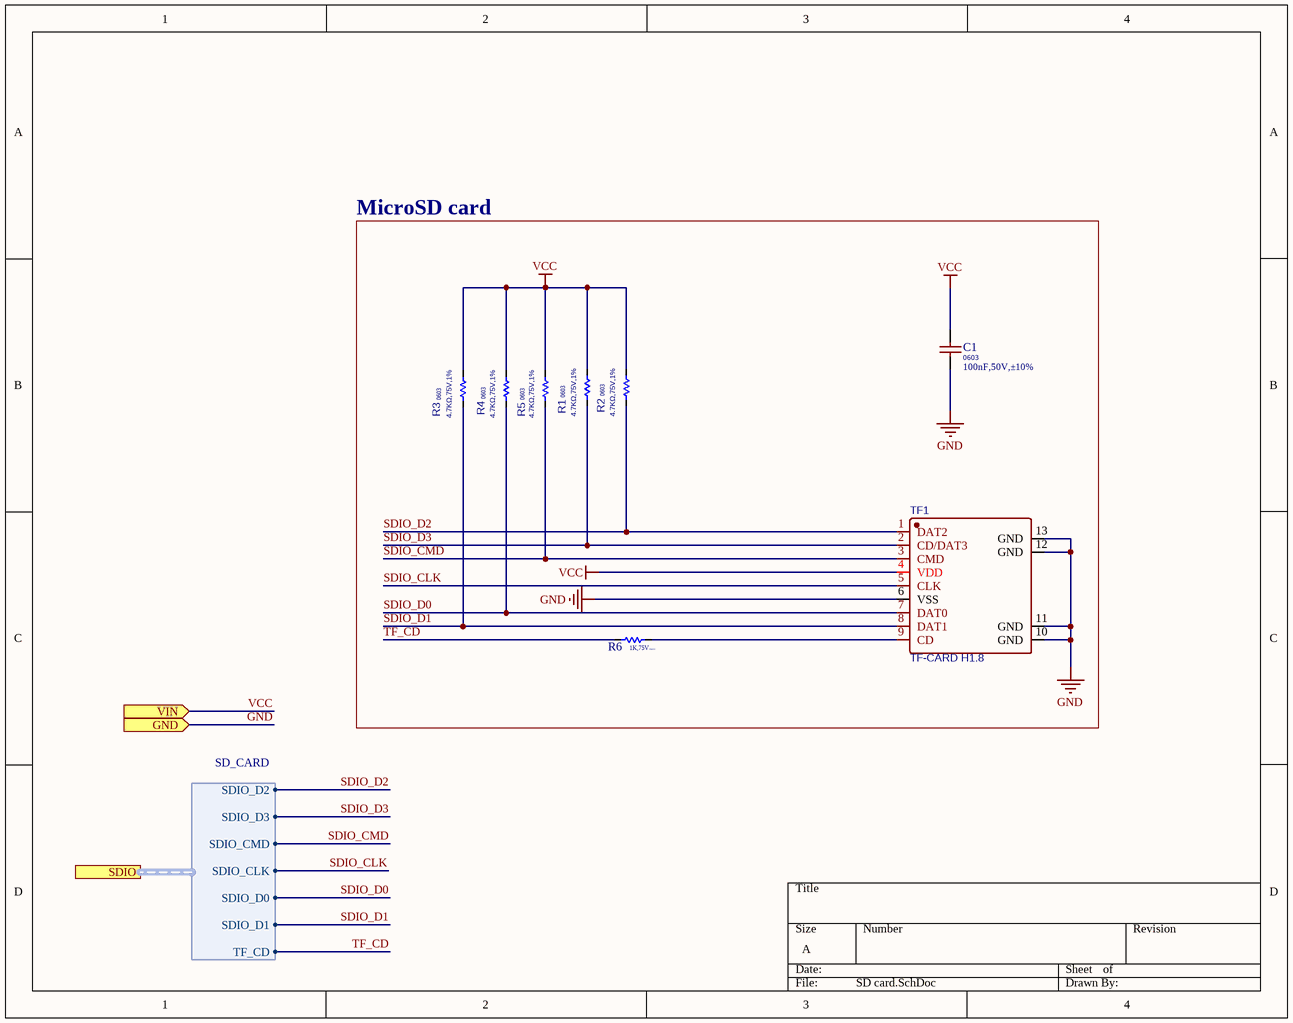
[diagram p4: SD card.SchDoc]

### Parts
C1  value 100nF,50V,±10%  Package: 0603  [C0603]  (hidden comment: CL10B104KB8NNNC)
R1  value 4.7KΩ,75V,1%  Package: 0603  [R0603]  (hidden comment: 4.7KΩ)
R2  value 4.7KΩ,75V,1%  Package: 0603  [R0603]  (hidden comment: 4.7KΩ)
R3  value 4.7KΩ,75V,1%  Package: 0603  [R0603]  (hidden comment: 4.7KΩ)
R4  value 4.7KΩ,75V,1%  Package: 0603  [R0603]  (hidden comment: 4.7KΩ)
R5  value 4.7KΩ,75V,1%  Package: 0603  [R0603]  (hidden comment: 4.7KΩ)
R6  value 1K,75V  Package: 0603  [R0603]  (hidden comment: 1K)
TF1  TF-CARD H1.8  [sd card connector]

### Blocks framed on the sheet
MicroSD card: C1 R1-R6 TF1

### Ports
GND (in), SDIO (harness SD_CARD), VIN (in)

### Harnesses
SD_CARD: SDIO_D2, SDIO_D3, SDIO_CMD, SDIO_CLK, SDIO_D0, SDIO_D1, TF_CD

### Nets
GND: C1.1 TF1.6(VSS) TF1.10(GND) TF1.11(GND) TF1.12(GND) TF1.13(GND) ; port GND
VCC: C1.2 R1.2 R2.2 R3.2 R4.2 R5.2 TF1.4(VDD) ; port VIN  [project net +3.3V]
SDIO_CLK: TF1.5(CLK) ; port SDIO.SDIO_CLK
SDIO_CMD: R5.1 TF1.3(CMD) ; port SDIO.SDIO_CMD
SDIO_D0: R4.1 TF1.7(DAT0) ; port SDIO.SDIO_D0
SDIO_D1: R3.1 TF1.8(DAT1) ; port SDIO.SDIO_D1
SDIO_D2: R2.1 TF1.1(DAT2) ; port SDIO.SDIO_D2
SDIO_D3: R1.1 TF1.2(CD/DAT3) ; port SDIO.SDIO_D3
TF_CD: R6.1 ; port SDIO.TF_CD  [project net SD_CARD_DETECT]
NetR6_2: R6.2 TF1.9(CD)

### Library data of the parts
C1 = CL10B104KB8NNNC: as C49 on sheet MAX31865ATP; Max Operating Temp: 125; Min Operating Temp: -55; MPN: CL10B104KB8NNNC; Datasheet: https://datasheet.lcsc.com/lcsc/2304140030_Samsung-Electro-Mechanics-CL10B104KB8NNNC_C1591.pdf; LCSC: C1591
R1-R5 = RC0603FR-074K7L: 100mW Thick Film Resistors 75V ±100ppm/℃ ±1% 4.7kΩ 0603 Chip Resistor - Surface Mount ROHS; Manufacturer: YAGEO; MPN: RC0603FR-071KL; Max Operating Temp: +155; Type: *; Datasheet: https://datasheet.lcsc.com/lcsc/2304140030_YAGEO-RC0603FR-074K7L_C99782.pdf; Min Operating Temp: -55; LCSC: C99782
R6 = 0603WAF1001T5E: 100mW Thick Film Resistors 75V ±100ppm/℃ ±1% 1kΩ 0603 Chip Resistor - Surface Mount ROHS; Manufacturer: UNI-ROYAL(Uniroyal Elec); Datasheet: https://datasheet.lcsc.com/szlcsc/Uniroyal-Elec-0603WAF1001T5E_C21190.pdf; MPN: 0603WAF1001T5E; LCSC: C21190
TF1 = TF-CARD H1.8: -40℃~+70℃ 1.8mm Gold Deck MicroSD card (TF card) Copper Alloy Self bomb SMD SD Card Connectors ROHS; Manufacturer: SHOU HAN; LCSC: C7529389; MPN: TF-CARD H1.8; Min Operating Temp: -40; Max Operating Temp: +70; Value: SMD SD Card Connector; Datasheet: https://datasheet.lcsc.com/lcsc/2308181409_SHOU-HAN-TF-CARD-H1-8_C7529389.pdf; Package Reference: MicroSD card (TF card)

## Sheet POWER SUPPLY.SchDoc
size A4; SheetNumber: 4; SheetTotal: 31
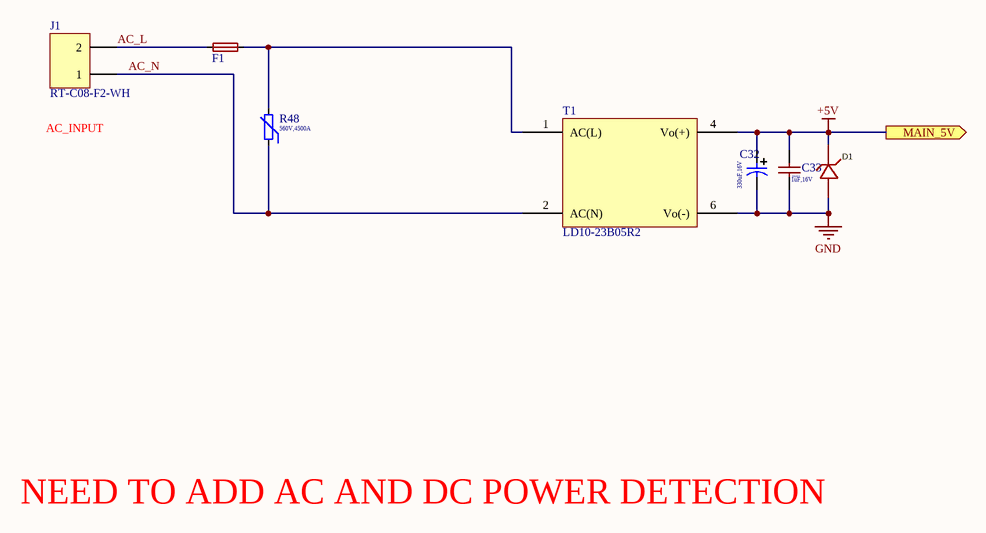
[diagram p5: POWER SUPPLY.SchDoc]

### Parts
C32  value 330uF,16V  [D10xL10.2mm]  (hidden comment: 330uF)
C33  value 1uF,16V  Package: 0603  [C0603]  (hidden comment: 1uF)
D1  SMBJ7.0A  [SMB(DO-214AA)]  (value not drawn)
F1  2009T2A250V  [F1]  (value not drawn)
J1  RT-C08-F2-WH  [AC POWER PORT]
R48  560V,4500A  [DIP-2(VR)]
T1  LD10-23B05R2  [DIP-4(LD10-23B05R2)]

### Ports
MAIN_5V (out)

### Nets
+5V: C32.1 C33.2 D1.1(C) T1.4(Vo(+)) ; port MAIN_5V  [project net VBUS2]
GND: C32.2 C33.1 D1.2(A) T1.6(Vo(-))
AC_L: F1.1 J1.2
AC_N: J1.1 R48.1 T1.2(AC(N))
NetF1_2: F1.2 R48.2 T1.1(AC(L))

### Notes on the sheet
- (near J1) AC_INPUT
- NEED TO ADD AC AND DC POWER DETECTION

### Library data of the parts
C32 = VUX331M1CTR-1010: 330uF 16V ±20% SMD,D10xL10mm Aluminum Electrolytic Capacitors - SMD ROHS; Manufacturer: Lelon; MPN: VUX331M1CTR-1010; Datasheet: https://www.lcsc.com/datasheet/lcsc_datasheet_2206301900_Lelon-VUX331M1CTR-1010_C3029698.pdf; LCSC: C3029698; Package: D10xL10mm
C33 = CL10B105KO8NNNC: 16V 1uF X7R ±10% 0603 Multilayer Ceramic Capacitors MLCC - SMD/SMT ROHS; Manufacturer: Samsung Electro-Mechanics; Datasheet: https://www.lcsc.com/datasheet/lcsc_datasheet_2304140030_Samsung-Electro-Mechanics-CL10B105KO8NNNC_C59782.pdf; LCSC: C59782; MPN: CL10B105KO8NNNC
D1 = SMBJ7.0A: 50A 12V 7.78V Unidirectional 7V SMB(DO-214AA) ESD and Surge Protection (TVS/ESD) ROHS; Manufacturer: FTR; Type: TVS; MPN: SMBJ7.0A; Package: SMB(DO-214AA); Datasheet: https://atta.szlcsc.com/upload/public/pdf/source/20200702/C693543_689073A8B3600FE22ABFFC0DC1402DD2.pdf; Reverse Stand-Off Voltage (Vrwm): 7V; Peak Pulse Current (Ipp)@10/1000us: 50A
F1 = 2009T2A250V: Plugin Fuses ROHS; Manufacturer: Hongda; Datasheet: https://datasheet.lcsc.com/lcsc/2009092033_Hongda-2009T2A250V_C529788.pdf; LCSC: C529788; MPN: 2009T2A250V
J1 = RT-C08-F2-WH: Plugin AC Power Connectors ROHS; Manufacturer: Legion; Datasheet: https://www.lcsc.com/datasheet/lcsc_datasheet_2311101854_Legion-RT-C08-F2-WH_C19190827.pdf; LCSC: C19190827; MPN: RT-C08-F2-WH
R48 = 14D561K: 560 V 4.5 kA Varistor 1 Circuit Through Hole Disc 14mm; Manufacturer: Shenzhen Ruilongyuan Electronics Co.Ltd; Datasheet: https://www.digikey.com/en/supplier-centers/shenzhen-ruilongyuan-electronics; MPN: 14D561K; LCSC: C113245; Value: 560V,4500A
T1 = LD10-23B05R2: Power supply module,Power Supplies ROHS; Manufacturer: LZTEC; Input voltage: 85~305VAC; MPN: LD10-23B05R2; LCSC: C20618067

## Sheet INPUT.SchDoc
size A4; SheetNumber: 5; SheetTotal: 30
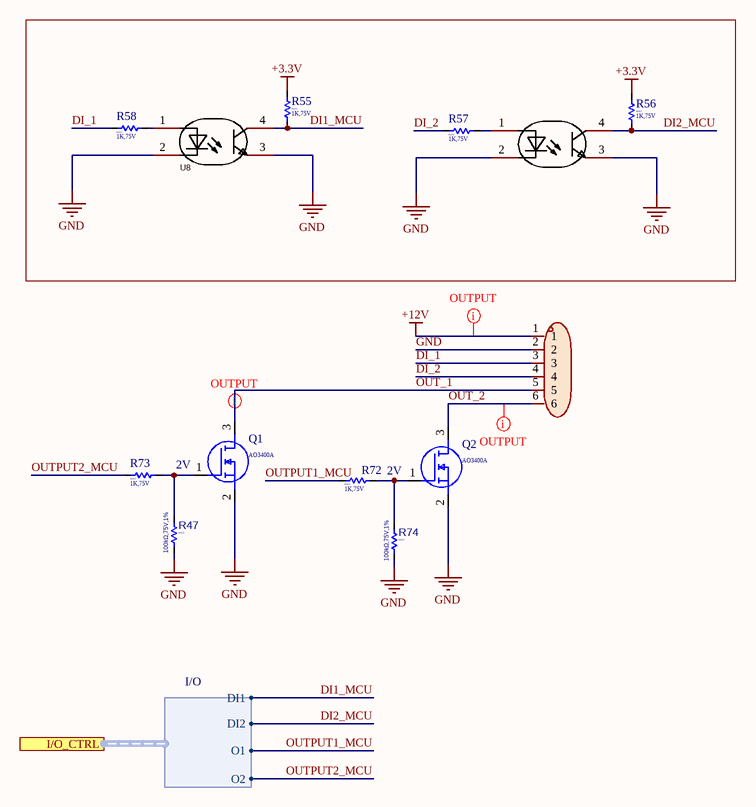
[diagram p6: INPUT.SchDoc]

### Parts
Q1  AO3400A  [SOT95P280X125-3N]
Q2  AO3400A  [SOT95P280X125-3N]
R47  value 100kΩ,75V,1%  Package: 0603  [R0603]  (hidden comment: 100K)
R55  value 1K,75V  Package: 0603  [R0603]  (hidden comment: 1K)
R56  value 1K,75V  Package: 0603  [R0603]  (hidden comment: 1K)
R57  value 1K,75V  Package: 0603  [R0603]  (hidden comment: 1K)
R58  value 1K,75V  Package: 0603  [R0603]  (hidden comment: 1K)
R72  value 1K,75V  Package: 0603  [R0603]  (hidden comment: 1K)
R73  value 1K,75V  Package: 0603  [R0603]  (hidden comment: 1K)
R74  value 100kΩ,75V,1%  Package: 0603  [R0603]  (hidden comment: 100K)
U7  PC817X3NSZ9F  [DIP-4]  (value not drawn)
U8  PC817X3NSZ9F  [DIP-4]  (value not drawn)
U9  DBT50G-6.35-6P-BK-P OGC  [6P_P=6.35mm]  (value not drawn)

### Ports
I/O_CTRL (harness I/O)

### Harnesses
I/O: DI1, DI2, O1, O2

### Nets
+3.3V: R55.2 R56.2
+12V: U9.1
GND: Q1.2(S) Q2.2(S) R47.1 R74.1 U7.2 U7.3 U8.2 U8.3 U9.2
DI1_MCU: R55.1 U8.4 ; port I/O_CTRL.DI1
DI2_MCU: R56.1 U7.4 ; port I/O_CTRL.DI2
DI_1: R58.2 U9.3
DI_2: R57.2 U9.4
OUT_1: Q1.3(D) U9.5
OUT_2: Q2.3(D) U9.6
OUTPUT1_MCU: R72.1 ; port I/O_CTRL.O1  [project net OUTPUT1]
OUTPUT2_MCU: R73.1 ; port I/O_CTRL.O2  [project net OUTPUT2]
NetQ1_1: Q1.1(G) R47.2 R73.2
NetQ2_1: Q2.1(G) R72.2 R74.2
NetR57_1: R57.1 U7.1
NetR58_1: R58.1 U8.1

### Layout directives
net class OUTPUT_NET: +12V, OUT_1, OUT_2

### Notes on the sheet
- 2V

### Library data of the parts
Q1 Q2 = AO3400A: MOSFET N-CH 30V 5.7A SOT23-3L; Manufacturer: Alpha & Omega Semiconductors; Datasheet: https://www.lcsc.com/datasheet/lcsc_datasheet_1811081213_Alpha---Omega-Semicon-AO3400A_C20917.pdf; MPN: AO3400A; LCSC: C20917; Package: SOT-23
R47 R74 = 0603WAF1003T5E: 100mW Thick Film Resistors 75V ±100ppm/℃ ±1% -55℃~+155℃ 100kΩ 0603 Chip Resistor - Surface Mount ROHS; Manufacturer: Royalohm; Type: *; Min Operating Temp: -55; MPN: 0603WAF1003T5E; Datasheet: https://www.mouser.com/datasheet/2/1365/1-3044649.pdf; Max Operating Temp: +125; LCSC: C25803
R55-R58 R72 R73 = 0603WAF1001T5E: as R6 on sheet SD card; Datasheet: https://datasheet.lcsc.com/szlcsc/Uniroyal-Elec-0603WAF1001T5E_C21190.pdf; MPN: 0603WAF1001T5E; LCSC: C21190
U7 U8 = PC817X3NSZ9F: Optoisolator Transistor Output 5000Vrms 1 Channel 4-DIP; Manufacturer: SHARP; Forward Voltage: 1.2V; Output Current: 50mA; Reverse Voltage: 6V; Receiving End Voltage: 80V; Number of Outputs: 1; MPN: PC817X3NSZ9F; LCSC: C96006; Package: DIP-4; Datasheet: https://atta.szlcsc.com/upload/public/pdf/source/20180614/C192269_7C74CFE0775652A463AD6B9F912AC892.pdf; Operating Temperature: -30℃~+100℃
U9 = DBT50G-6.35-6P-BK-P OGC: as U16 on sheet MAX31865ATP; Supplier Part: C5179475; Manufacturer Part: DBT50G-6.35-6P-BK-P OGC; Supplier Footprint: 插件,P=6.35mm; Datasheet: https://atta.szlcsc.com/upload/public/pdf/source/20230321/4A82F27AE8A2F5607DB8D935518A4E7A.pdf; Operating Temperature Range: -40℃~+105℃

## Sheet STM32F446RET6.SchDoc
size A4; SheetNumber: 10; SheetTotal: 31
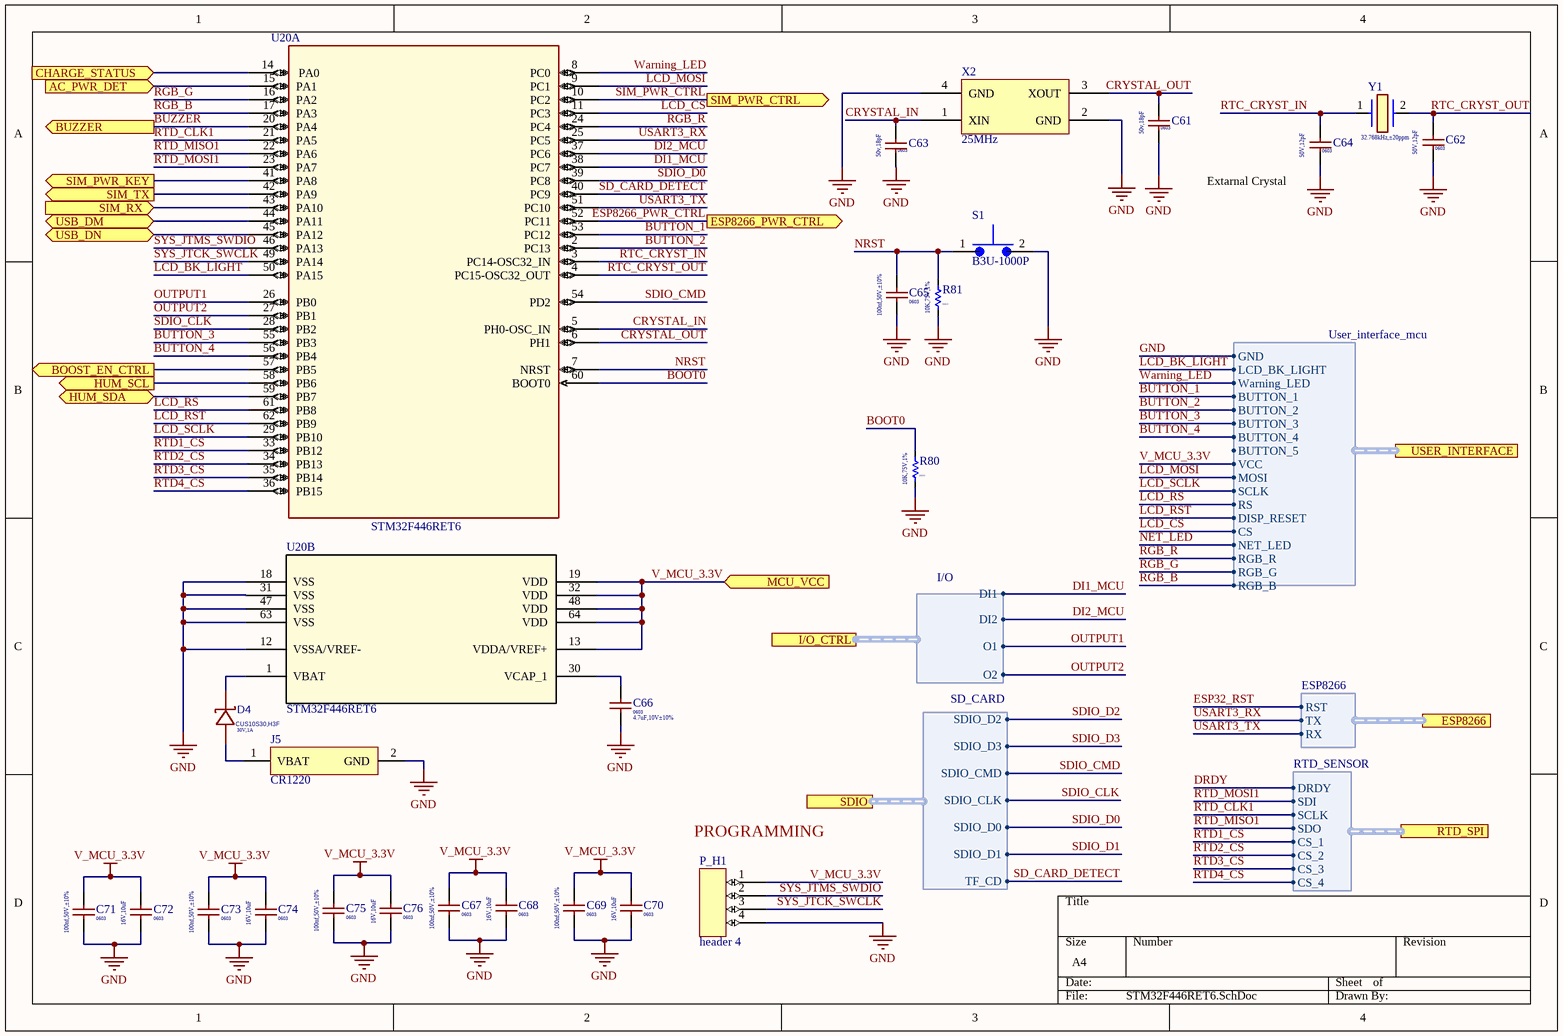
[diagram p7: STM32F446RET6.SchDoc]

### Parts
C61  value 50v,18pF  Package: 0603  [CAPC1608X90N]  (hidden comment: 18pF)
C62  value 50V,12pF  Package: 0603  [CAPC1608X90N]  (hidden comment: 12pF)
C63  value 50v,18pF  Package: 0603  [CAPC1608X90N]  (hidden comment: 18pF)
C64  value 50V,12pF  Package: 0603  [CAPC1608X90N]  (hidden comment: 12pF)
C65  value 100nf,50V,±10%  Package: 0603  [C0603]  (hidden comment: CC0603KRX7R9BB104)
C66  value 4.7uF,10V±10%  Package: 0603  [C0603]  (hidden comment: 4.7uf)
C67  value 100nf,50V,±10%  Package: 0603  [C0603]  (hidden comment: CC0603KRX7R9BB104)
C68  value 16V,10uF  Package: 0603  [CAPC1608X90N]  (hidden comment: 10uf)
C69  value 100nf,50V,±10%  Package: 0603  [C0603]  (hidden comment: CC0603KRX7R9BB104)
C70  value 16V,10uF  Package: 0603  [CAPC1608X90N]  (hidden comment: 10uf)
C71  value 100nf,50V,±10%  Package: 0603  [C0603]  (hidden comment: CC0603KRX7R9BB104)
C72  value 16V,10uF  Package: 0603  [CAPC1608X90N]  (hidden comment: 10uf)
C73  value 100nf,50V,±10%  Package: 0603  [C0603]  (hidden comment: CC0603KRX7R9BB104)
C74  value 16V,10uF  Package: 0603  [CAPC1608X90N]  (hidden comment: 10uf)
C75  value 100nf,50V,±10%  Package: 0603  [C0603]  (hidden comment: CC0603KRX7R9BB104)
C76  value 16V,10uF  Package: 0603  [CAPC1608X90N]  (hidden comment: 10uf)
D4  CUS10S30,H3F  value 30V,1A  [SOD-323]
J5  CR1220  [CR1220 SMD]
P_H1  header 4  [pin header 4]
R80  Package: 0603  [R0603]  (hidden comment: 10K,75V,1%)
R81  Package: 0603  [R0603]  (hidden comment: 10K,75V,1%)
S1  B3U-1000P  [B3U-1000P]
U20  STM32F446RET6  [QFP50P1200X1200X160-64N]  (parts A,B of 2)
X2  25MHz  [SMD Crystal]
Y1  value 32.768kHz,±20ppm  [SMD3215-2P]  (hidden comment: 32.768kHz)

### Ports
AC_PWR_DET (in), BOOST_EN_CTRL (out), BUZZER (out), CHARGE_STATUS (in), ESP8266 (harness ESP8266), ESP8266_PWR_CTRL (out), HUM_SCL (out), HUM_SDA (bidir), I/O_CTRL (harness I/O), MCU_VCC (in), RTD_SPI (harness RTD_SENSOR), SDIO (harness SD_CARD), SIM_PWR_CTRL (out), SIM_PWR_KEY (out), SIM_RX (in), SIM_TX (out), USB_DM (bidir), USB_DN (bidir), USER_INTERFACE (harness User_interface_mcu)

### Harnesses
RTD_SENSOR: DRDY, SDI, SCLK, CS_1, CS_2, CS_3, CS_4, SDO
SD_CARD: SDIO_D2, SDIO_D3, SDIO_CMD, SDIO_CLK, SDIO_D0, SDIO_D1, TF_CD
ESP8266: RST, TX, RX
User_interface_mcu: GND, LCD_BK_LIGHT, BUTTON_1, Warning_LED, BUTTON_2, BUTTON_3, BUTTON_4, BUTTON_5, VCC, MOSI, SCLK, RS, DISP_RESET, CS, NET_LED, RGB_R, RGB_G, RGB_B
I/O: DI1, DI2, O1, O2

### Nets
GND: C61.1 C62.1 C63.1 C64.1 C65.1 C66.1 C67.1 C68.1 C69.1 C70.1 C71.1 C72.1 C73.1 C74.1 C75.1 C76.1 J5.2(GND) P_H1.4 R80.2 R81.2 S1.2 U20.12(VSSA/VREF-) U20.18(VSS) U20.31(VSS) U20.47(VSS) U20.63(VSS) X2.2(GND) X2.4(GND) ; port USER_INTERFACE.GND
V_MCU_3.3V: C67.2 C68.2 C69.2 C70.2 C71.2 C72.2 C73.2 C74.2 C75.2 C76.2 P_H1.1 U20.13(VDDA/VREF+) U20.19(VDD) U20.32(VDD) U20.48(VDD) U20.64(VDD) ; port MCU_VCC, port USER_INTERFACE.VCC  [project net +3.3V]
BOOST_COV_ON/OFF: U20.57(PB5) ; port BOOST_EN_CTRL
BOOT0: R80.1 U20.60(BOOT0)
BUTTON_1: U20.53(PC12) ; port USER_INTERFACE.BUTTON_1
BUTTON_2: U20.2(PC13) ; port USER_INTERFACE.BUTTON_2
BUTTON_3: U20.55(PB3) ; port USER_INTERFACE.BUTTON_3
BUTTON_4: U20.56(PB4) ; port USER_INTERFACE.BUTTON_4
BUZZER: U20.20(PA4) ; port BUZZER
CHARGE_STATUS: U20.14(PA0) ; port CHARGE_STATUS
CRYSTAL_IN: C63.2 U20.5(PH0-OSC_IN) X2.1(XIN)
CRYSTAL_OUT: C61.2 U20.6(PH1) X2.3(XOUT)
DI1_MCU: U20.38(PC7) ; port I/O_CTRL.DI1
DI2_MCU: U20.37(PC6) ; port I/O_CTRL.DI2
DRDY: port RTD_SPI.DRDY
ESP8266_PWR_CTRL: U20.52(PC11) ; port ESP8266_PWR_CTRL
I2C1_SCL: U20.58(PB6) ; port HUM_SCL
I2C1_SDA: U20.59(PB7) ; port HUM_SDA
LCD_BK_LIGHT: U20.50(PA15) ; port USER_INTERFACE.LCD_BK_LIGHT
LCD_CS: U20.11(PC3) ; port USER_INTERFACE.CS  [project net CS]
LCD_MOSI: U20.9(PC1) ; port USER_INTERFACE.MOSI
LCD_RS: U20.61(PB8) ; port USER_INTERFACE.RS
LCD_RST: U20.62(PB9) ; port USER_INTERFACE.DISP_RESET  [project net DISP_RESET]
LCD_SCLK: U20.29(PB10) ; port USER_INTERFACE.SCLK
NET_LED: port USER_INTERFACE.NET_LED
NRST: C65.2 R81.1 S1.1 U20.7(NRST)
OUTPUT1: U20.26(PB0) ; port I/O_CTRL.O1
OUTPUT2: U20.27(PB1) ; port I/O_CTRL.O2
PG_STATUS: U20.15(PA1) ; port AC_PWR_DET
RGB_B: U20.17(PA3) ; port USER_INTERFACE.RGB_B
RGB_G: U20.16(PA2) ; port USER_INTERFACE.RGB_G
RGB_R: U20.24(PC4) ; port USER_INTERFACE.RGB_R
RTC_CRYST_IN: C64.2 U20.3(PC14-OSC32_IN) Y1.1(CRYSTAL_2)
RTC_CRYST_OUT: C62.2 U20.4(PC15-OSC32_OUT) Y1.2
RTD1_CS: U20.33(PB12) ; port RTD_SPI.CS_1  [project net CS_1]
RTD2_CS: U20.34(PB13) ; port RTD_SPI.CS_2  [project net CS_2]
RTD3_CS: U20.35(PB14) ; port RTD_SPI.CS_3  [project net CS_3]
RTD4_CS: U20.36(PB15) ; port RTD_SPI.CS_4  [project net CS_4]
RTD_CLK1: U20.21(PA5) ; port RTD_SPI.SCLK
RTD_MISO1: U20.22(PA6) ; port RTD_SPI.SDO
RTD_MOSI1: U20.23(PA7) ; port RTD_SPI.SDI
SD_CARD_DETECT: U20.40(PC9) ; port SDIO.TF_CD
SDIO_CLK: U20.28(PB2) ; port SDIO.SDIO_CLK
SDIO_CMD: U20.54(PD2) ; port SDIO.SDIO_CMD
SDIO_D0: U20.39(PC8) ; port SDIO.SDIO_D0
SIM_PWR_CTRL: U20.10(PC2) ; port SIM_PWR_CTRL  [project net MDM_PWR_RST]
SYS_JTCK_SWCLK: P_H1.3 U20.49(PA14)
SYS_JTMS_SWDIO: P_H1.2 U20.46(PA13)
USART3_RX: U20.25(PC5) ; port ESP8266.TX  [project net ESP_TXD]
USART3_TX: U20.51(PC10) ; port ESP8266.RX  [project net ESP_RXD]
USB1_D_N: U20.45(PA12) ; port USB_DN
USB1_D_P: U20.44(PA11) ; port USB_DM
Warning_LED: U20.8(PC0) ; port USER_INTERFACE.Warning_LED
NetC66_2: C66.2 U20.30(VCAP_1)
NetD4_1: D4.1(K) U20.1(VBAT)
NetD4_2: D4.2(A) J5.1(VBAT)
NetR86_1: U20.41(PA8) ; port SIM_PWR_KEY
NetU20_42: U20.42(PA9) ; port SIM_TX
NetU20_43: U20.43(PA10) ; port SIM_RX

### Notes on the sheet
- (near C64) Extarnal Crystal
- (near P_H1) PROGRAMMING

### Library data of the parts
C61 C63 = CC0603JRNPO9BN180: 50V 18pF NP0 ±5% 0603 Multilayer Ceramic Capacitors MLCC - SMD/SMT ROHS; Manufacturer: YAGEO; LCSC: C107040; Datasheet: https://www.lcsc.com/datasheet/lcsc_datasheet_2304140030_YAGEO-CC0603JRNPO9BN180_C107040.pdf; MPN: CC0603JRNPO9BN180
C62 C64 = 0603CG120J500NT: 50V 12pF C0G ±5% 0603 Multilayer Ceramic Capacitors MLCC - SMD/SMT ROHS; Manufacturer: FH; Datasheet: https://datasheet.lcsc.com/lcsc/2304140030_FH--Guangdong-Fenghua-Advanced-Tech-0603CG120J500NT_C1642.pdf; LCSC: C1642; MPN: 0603CG120J500NT
C65 C67 C69 C71 C73 C75 = CC0603KRX7R9BB104: as C41 on sheet BQ24259RGER; Max Operating Temp: 35 °C; Min Operating Temp: 15 °C; Datasheet: http://componentsearchengine.com/Datasheets/3/CC0603KRX7R9BB104.pdf; LCSC: C14663
C66 = 0603B475K100NT: as C42 on sheet BQ24259RGER; Datasheet: https://lcsc.componentsearchengine.com/Datasheets/2/CL10A475KQ8NNNC.pdf
C68 C70 C72 C74 C76 = 0603F106M160NT: 16V 10uF Y5V ±20% 0603 Multilayer Ceramic Capacitors MLCC - SMD/SMT ROHS; Manufacturer: KEMET; MPN: CC0603KRX7R9BB104; Datasheet: http://componentsearchengine.com/Datasheets/3/CC0603KRX7R9BB104.pdf; LCSC: C48906
D4 = CUS10S30,H3F: Diode 30 V 1A Schottky Barrier Diodes Surface Mount USC; Manufacturer: TOSHIBA; MPN: CUS10S30,H3F; LCSC: C146335; Datasheet: https://datasheet.lcsc.com/lcsc/1810181811_TOSHIBA-CUS10S30-H3F_C146335.pdf; Package: SC-76(SOD-323)
J5 = CR1220: Manufacturer: Q&J; Datasheet: https://datasheet.lcsc.com/lcsc/1811061932_Q-J-CR1220-2_C70381.pdf; LCSC: C70381
P_H1 = header 4: Straight 2.54mm 6mm -40℃~+105℃ 1 3mm 4 2.54mm Black Brass 1x4P Straight,P=2.54mm Pin Headers ROHS
R80 R81 = 0603WAF1002T5E: 100mW Thick Film Resistors ±100ppm/℃ ±1% 10kΩ 0603 Chip Resistor - Surface Mount ROHS; Manufacturer: UNI-ROYAL(Uniroyal Elec); Max Operating Temp: 155℃; Min Operating Temp: -55℃; MPN: 0603WAF1002T5E; Datasheet: https://datasheet.lcsc.com/szlcsc/Uniroyal-Elec-0603WAF1002T5E_C25804.pdf; LCSC: C25804; Value: 10K,75V,1%
S1 = B3U-1000P: 2.5mm 1.6mm Round Button 50mA Brick nogging 3mm SPST 153gf 12V SMD,2.5x3mm Tactile Switches ROHS; Manufacturer: Omron Electronics; MPN: 653-B3U-1000P; Datasheet: https://www.omron.com/ecb/products/pdf/en-b3u.pdf; LCSC: C231329
U20 = STM32F446RET6: IC MCU 32BIT 512KB FLASH 64LQFP; Manufacturer: STMicroelectronics; MPN: STM32F446RET6; Package: LQFP-64(10x10); LCSC: C69336; Datasheet: https://www.lcsc.com/datasheet/lcsc_datasheet_2410010204_STMicroelectronics-STM32F446RET6_C69336.pdf; Operating Temperature: -40°C ~ 85°C
X2 = 3TJ425000XYFBC: 25MHz 18pF ±10ppm ±30ppm SMD3225-4P Crystals ROHS; Manufacturer: JYJE; MPN: 3TJ425000XYFBC; Package: SMD3225-4P; Datasheet: https://www.lcsc.com/datasheet/lcsc_datasheet_2304140030_JYJE-3TJ425000XYFBC_C2149071.pdf; LCSC: C2149071
Y1 = Q13FC1350000400: 32.768kHz SMD Crystal Resonator 12.5pF 70kΩ ±20ppm -40℃~+85℃ SMD3215-2P Crystals ROHS; Manufacturer: Seiko Epson; MPN: Q13FC1350000400; Datasheet: https://datasheet.lcsc.com/lcsc/1810171817_Seiko-Epson-Q13FC13500004_C32346.pdf; Package: SMD3215-2P; LCSC: C32346

## Sheet USB.SchDoc
size A; SheetNumber: 3; SheetTotal: 31
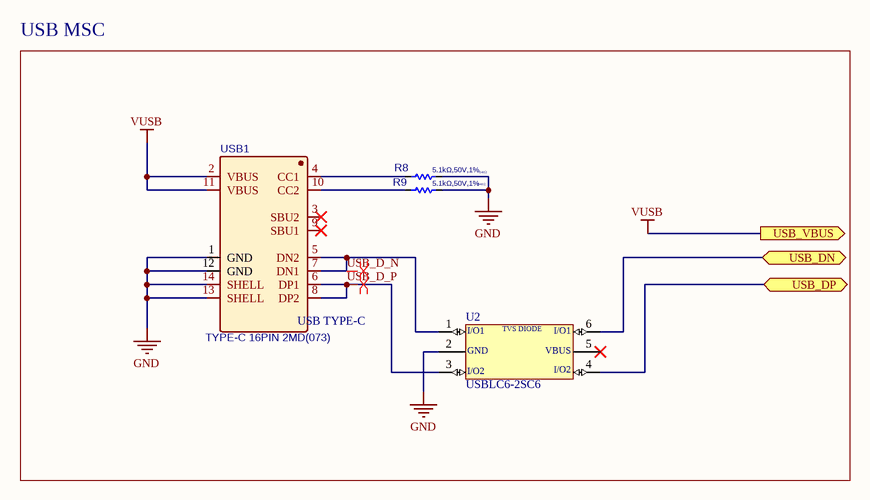
[diagram p8: USB.SchDoc]

### Parts
R8  value 5.1kΩ,50V,1%  Package: 0402  [R0402]  (hidden comment: 5.1KΩ)
R9  value 5.1kΩ,50V,1%  Package: 0402  [R0402]  (hidden comment: 5.1KΩ)
U2  USBLC6-2SC6  [SOT95P280X145-6N]
USB1  TYPE-C 16PIN 2MD(073)  [TYPE-C 16PIN 2MD(073)]

### Blocks framed on the sheet
USB MSC: R8 R9 U2 USB1

### Ports
USB_DN (bidir), USB_DP (bidir), USB_VBUS (out)

### Nets
GND: R8.2 R9.2 U2.2(GND) USB1.1(GND) USB1.12(GND) USB1.13(SHELL) USB1.14(SHELL)
VUSB: USB1.2(VBUS) USB1.11(VBUS) ; port USB_VBUS
USB1_D_N: U2.6(I/O1_OUT) ; port USB_DN
USB1_D_P: U2.4(I/O2_OUT) ; port USB_DP
USB_D_N: U2.1(I/O1_IN) USB1.5(DN2) USB1.7(DN1)
USB_D_P: U2.3(I/O2_IN) USB1.6(DP1) USB1.8(DP2)
NetR8_1: R8.1 USB1.4(CC1)
NetR9_1: R9.1 USB1.10(CC2)

Not connected (* = marked no-connect by the designer): U2 5(VBUS)*; USB1 3(SBU2)* 9(SBU1)*

### Layout directives
differential pair; net class USB: USB_D_N, USB_D_P

### Notes on the sheet
- (in symbol TYPE-C 16PIN 2MD(073)) USB TYPE-C
- (in symbol USBLC6-2SC6) I/O1; TVS DIODE; I/O2

### Library data of the parts
R8 R9 = RC0402FR-075K1L: 100mW Thick Film Resistors 75V ±100ppm/℃ ±1% 100kΩ 0603 Chip Resistor - Surface Mount ROHS; Manufacturer: YAGEO; Max Operating Temp: +155; MPN: RC0402FR-075K1L; Type: *; Datasheet: https://datasheet.lcsc.com/lcsc/2304140030_YAGEO-RC0402FR-075K1L_C105872.pdf; Min Operating Temp: -55; LCSC: C105872
U2 = USBLC6-2SC6: 17V Clamp 5A (8/20Âµs) Ipp Tvs Diode Surface Mount SOT-23-6; MF: STMicroelectronics; Value: *; Package: SOT-23-6 STMicroelectronics; MP: USBLC6-2SC6
USB1 = TYPE-C 16PIN 2MD(073): 5A 1 Surface Mount 16P Female -25℃~+85℃ Type-C SMD USB Connectors ROHS; Manufacturer: SHOU HAN(首韩); LCSC: C2765186; Package Reference: TYPE-C 16PIN 2MD(073)

## Sheet 3.4_4.2V_TO_FIXED_3.3V.SchDoc
size A; SheetNumber: 6; SheetTotal: 30
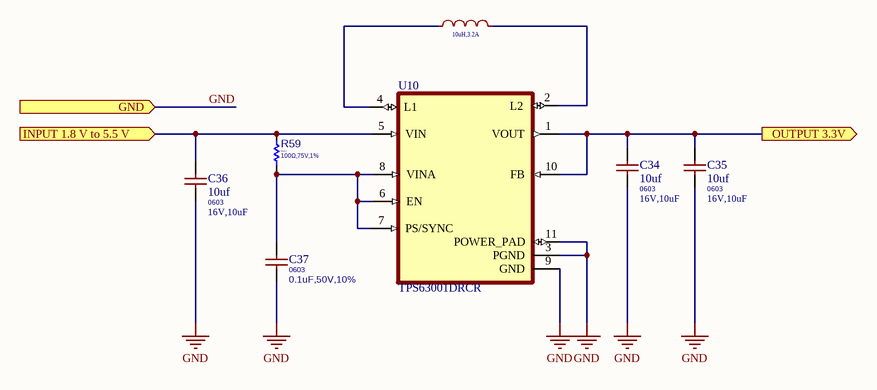
[diagram p9: 3.4_4.2V_TO_FIXED_3.3V.SchDoc]

### Parts
C34  10uf  value 16V,10uF  Package: 0603  [CAPC1608X90N]
C35  10uf  value 16V,10uF  Package: 0603  [CAPC1608X90N]
C36  10uf  value 16V,10uF  Package: 0603  [CAPC1608X90N]
C37  Package: 0603  [C0603]  (hidden comment: 0.1uF,50V,10%)
L1  value 10uH,3.2A  [inductor_SMD,5.2x5.4mm]  (hidden comment: 10uH)
R59  value 100Ω,75V,1%  Package: 0603  [R0603]  (hidden comment: 100Ω)
U10  TPS63001DRCR  [VREG_V62/16624-01YE]

### Ports
GND (in), INPUT 1.8 V to 5.5 V (in), OUTPUT 3.3V (out)

### Nets
+4.2V: C36.2 R59.2 U10.5(VIN) ; port INPUT 1.8 V to 5.5 V
GND: C34.1 C35.1 C36.1 C37.1 U10.3(PGND) U10.9(GND) U10.11(POWER_PAD) ; port GND
NetC34_2: C34.2 C35.2 U10.1(VOUT) U10.10(FB) ; port OUTPUT 3.3V
NetC37_2: C37.2 R59.1 U10.6(EN) U10.7(PS/SYNC) U10.8(VINA)
NetL1_1: L1.1 U10.4(L1)
NetL1_2: L1.2 U10.2(L2)

### Library data of the parts
C34-C36 = 0603F106M160NT: as C68 on sheet STM32F446RET6; Datasheet: http://componentsearchengine.com/Datasheets/3/CC0603KRX7R9BB104.pdf; LCSC: C48906
C37 = GCM188R71H104KA57J: as C48 on sheet PWR_CTRL; Min Operating Temp: -55°C; Max Operating Temp: 125°C; MPN: GCM188R71H104KA57J; Datasheet: https://datasheet.lcsc.com/lcsc/2404081050_Murata-Electronics-GCM188R71H104KA57J_C3011652.pdf; LCSC: C3011652; Value: 0.1uF,50V,10%
L1 = FXL0530-100-M: as L2 on sheet BQ24259RGER; LCSC: C177248; MPN: FXL0530-100-M; Package: SMD,5.2x5.4mm; Datasheet: https://atta.szlcsc.com/upload/public/pdf/source/20240426/3189EA8206330E2108542F9E34E540E7.pdf
R59 = AC0603FR-13100RL: 100mW Thick Film Resistors 75V ±100ppm/℃ ±1% 100Ω 0603 Chip Resistor - Surface Mount ROHS; Manufacturer: YAGEO(国巨); Min Operating Temp: -55; Max Operating Temp: +155; Type: *; MPN: AC0603FR-13100RL; Datasheet: https://datasheet.lcsc.com/lcsc/2201180400_YAGEO-AC0603FR-13100RL_C1512172.pdf; LCSC: C1512172
U10 = TPS63001DRCR: 96% Buck-Boost Converter with 1.7A Current Switches, 3.3V fixed Output voltage in 3x3 QFN 10-VSON -40 to 85; MF: Texas Instruments; Texas_Instruments-Purchase-URL: https://snapeda.com/shop?store=Texas+Instruments&id=214718; Value: *; Availability: Good; SnapEDA_Link: https://www.snapeda.com/parts/TPS63001DRCR/Texas%20Instruments/view-part/214718/?ref=snap; Mouser-Purchase-URL: https://snapeda.com/shop?store=Mouser&id=214718; Package: VSON-10 Texas Instruments; DigiKey-Purchase-URL: https://snapeda.com/shop?store=DigiKey&id=214718; MP: TPS63001DRCR; Price: None

## Sheet SIM7600G-H.SchDoc
size A4; SheetNumber: 11; SheetTotal: 31
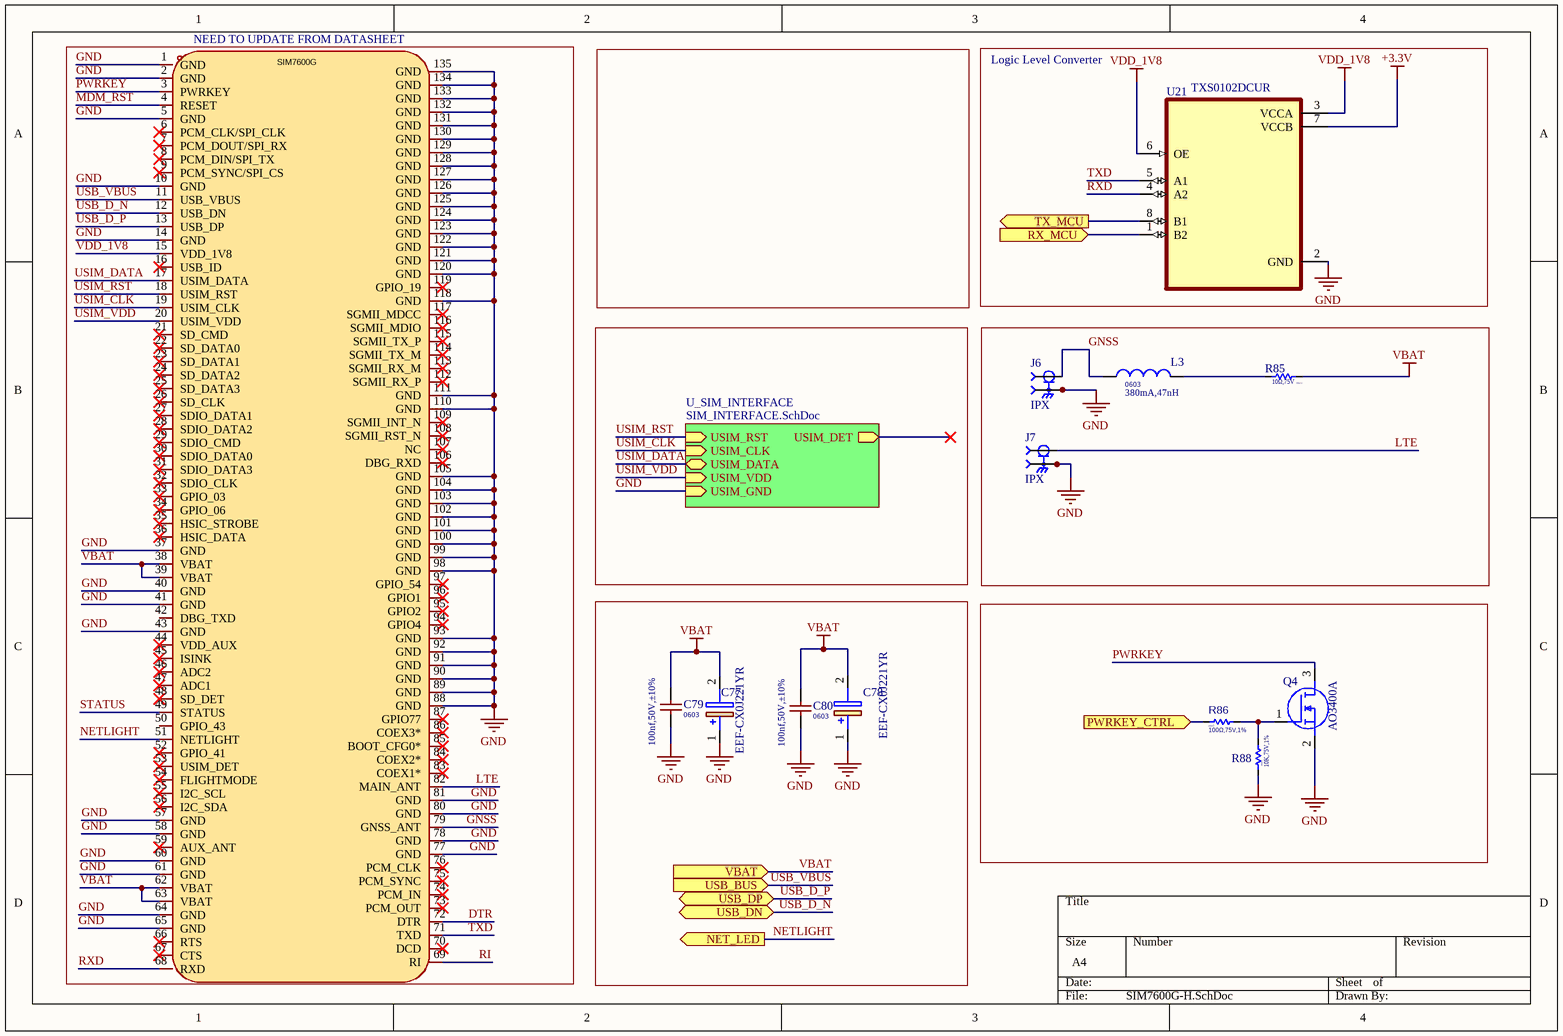
[diagram p10: SIM7600G-H.SchDoc]

### Parts
C77  EEF-CX0J221YR  [CAPPM7343X200N]
C78  EEF-CX0J221YR  [CAPPM7343X200N]
C79  value 100nf,50V,±10%  Package: 0603  [C0603]  (hidden comment: CC0603KRX7R9BB104)
C80  value 100nf,50V,±10%  Package: 0603  [C0603]  (hidden comment: CC0603KRX7R9BB104)
J6  IPX  [IPEX_20279-001E-03]
J7  IPX  [IPEX_20279-001E-03]
L3  value 380mA,47nH  Package: 0603  [LQW18AN47NG00D]  (hidden comment: LQW18AN47NG00D)
Q4  AO3400A  [SOT95P280X125-3N]
R85  value 10Ω,75V  Package: 0603  [R0603]  (hidden comment: 10R)
R86  value 100Ω,75V,1%  Package: 0603  [R0603]  (hidden comment: 100Ω)
R88  Package: 0603  [R0603]  (hidden comment: 10K,75V,1%)
U21  TXS0102DCUR  [8-VSSOP]
U22  SIM7600G  [SMD,30x30mm]

### Blocks framed on the sheet
NEED TO UPDATE FROM DATASHEET: U22
Logic Level Converter: U21

### Sub-sheets
U_SIM_INTERFACE = SIM_INTERFACE.SchDoc: USIM_RST (in), USIM_CLK (in), USIM_DATA (bidir), USIM_DET (out), USIM_VDD (in), USIM_GND (in)

### Ports
NET_LED (out), PWRKEY_CTRL (in), RX_MCU (in), TX_MCU (out), USB_BUS (in), USB_DN (bidir), USB_DP (bidir), VBAT (in)

### Nets
+3.3V: U21.7(VCCB)
GND: C77.1(+) C78.1(+) C79.1 C80.1 J6.2(GND) J6.3(GND) J7.2(GND) J7.3(GND) Q4.2(S) R88.1 U21.2(GND) U22.1(GND) U22.2(GND) U22.5(GND) U22.10(GND) U22.14(GND) U22.37(GND) U22.40(GND) U22.41(GND) U22.43(GND) U22.57(GND) U22.58(GND) U22.60(GND) U22.61(GND) U22.64(GND) U22.65(GND) U22.77(GND) U22.78(GND) U22.80(GND) U22.81(GND) U22.88(GND) U22.89(GND) U22.90(GND) U22.91(GND) U22.92(GND) U22.93(GND) U22.98(GND) U22.99(GND) U22.100(GND) U22.101(GND) U22.102(GND) U22.103(GND) U22.104(GND) U22.105(GND) U22.110(GND) U22.111(GND) U22.118(GND) U22.120(GND) U22.121(GND) U22.122(GND) U22.123(GND) U22.124(GND) U22.125(GND) U22.126(GND) U22.127(GND) U22.128(GND) U22.129(GND) U22.130(GND) U22.131(GND) U22.132(GND) U22.133(GND) U22.134(GND) U22.135(GND) ; sheet U_SIM_INTERFACE/USIM_GND
USIM_VDD: U22.20(USIM_VDD) ; sheet U_SIM_INTERFACE/USIM_VDD
VBAT: C77.2(-) C78.2(-) C79.2 C80.2 R85.2 U22.38(VBAT) U22.39(VBAT) U22.62(VBAT) U22.63(VBAT) ; port VBAT
VDD_1V8: U21.3(VCCA) U21.6(OE) U22.15(VDD_1V8)
DTR: U22.72(DTR)
GNSS: J6.1(SIG) L3.1 U22.79(GNSS_ANT)
LTE: J7.1(SIG) U22.82(MAIN_ANT)
MDM_RST: U22.4(RESET)
NETLIGHT: U22.51(NETLIGHT) ; port NET_LED  [project net NET_LED]
PWRKEY: Q4.3(D) U22.3(PWRKEY)
RI: U22.69(RI)
RXD: U21.4(A2) U22.68(RXD)
STATUS: U22.49(STATUS)
TXD: U21.5(A1) U22.71(TXD)
USB_D_N: U22.12(USB_DN) ; port USB_DN
USB_D_P: U22.13(USB_DP) ; port USB_DP
USB_VBUS: U22.11(USB_VBUS) ; port USB_BUS
USIM_CLK: U22.19(USIM_CLK) ; sheet U_SIM_INTERFACE/USIM_CLK
USIM_DATA: U22.17(USIM_DATA) ; sheet U_SIM_INTERFACE/USIM_DATA
USIM_RST: U22.18(USIM_RST) ; sheet U_SIM_INTERFACE/USIM_RST
NetL3_2: L3.2 R85.1
NetQ4_1: Q4.1(G) R86.2 R88.2
NetR86_1: R86.1 ; port PWRKEY_CTRL
NetU20_42: U21.1(B2) ; port RX_MCU
NetU20_43: U21.8(B1) ; port TX_MCU

Not connected (* = marked no-connect by the designer): U22 6(PCM_CLK/SPI_CLK)* 7(PCM_DOUT/SPI_RX)* 8(PCM_DIN/SPI_TX)* 9(PCM_SYNC/SPI_CS)* 16(USB_ID)* 21(SD_CMD)* 22(SD_DATA0)* 23(SD_DATA1)* 24(SD_DATA2)* 25(SD_DATA3)* 26(SD_CLK)* 27(SDIO_DATA1)* 28(SDIO_DATA2)* 29(SDIO_CMD)* 30(SDIO_DATA0)* 31(SDIO_DATA3)* 32(SDIO_CLK)* 33(GPIO_03)* 34(GPIO_06)* 35(HSIC_STROBE)* 36(HSIC_DATA)* 42(DBG_TXD) 44(VDD_AUX)* 45(ISINK)* 46(ADC2)* 47(ADC1)* 48(SD_DET)* 50(GPIO_43) 52(GPIO_41)* 53(USIM_DET)* 54(FLIGHTMODE)* 55(I2C_SCL)* 56(I2C_SDA)* 59(AUX_ANT)* 66(RTS)* 67(CTS)* 70(DCD)* 73(PCM_OUT)* 74(PCM_IN)* 75(PCM_SYNC)* 76(PCM_CLK)* 83(COEX1*)* 84(COEX2*)* 85(BOOT_CFG0*)* 86(COEX3*)* 87(GPIO77)* 94(GPIO4)* 95(GPIO2)* 96(GPIO1)* 97(GPIO_54)* 106(DBG_RXD)* 107(NC)* 108(SGMII_RST_N)* 109(SGMII_INT_N)* 112(SGMII_RX_P)* 113(SGMII_RX_M)* 114(SGMII_TX_M)* 115(SGMII_TX_P)* 116(SGMII_MDIO)* 117(SGMII_MDCC)* 119(GPIO_19)*

### Library data of the parts
C77 C78 = EEF-CX0J221YR: as C40 on sheet BQ24259RGER; Datasheet Link: https://datasheet.lcsc.com/szlcsc/PANASONIC-EEFCX0J221YR_C141444.pdf; Height: 2mm; Manufacturer_Part_Number: EEF-CX0J221YR; Mouser Part Number: N/A; Mouser Price/Stock: https://www.mouser.com/Search/Refine.aspx?Keyword=N%2FA
C79 C80 = CC0603KRX7R9BB104: as C41 on sheet BQ24259RGER; Max Operating Temp: 35 °C; Min Operating Temp: 15 °C; Datasheet: http://componentsearchengine.com/Datasheets/3/CC0603KRX7R9BB104.pdf; LCSC: C14663
J6 J7 = 20279-001E-03: Small form factor with big performance through 6 GHz; Manufacturer: I-PEX; Package Reference: None; Value: *; MPN: 20279-001E-03; LCSC: C3173448
L3 = LQW18AN47NG00D: 47 nH Unshielded Drum Core, Wirewound Inductor 380 mA 290mOhm Max 0603 (1608 Metric); Manufacturer: Murata Electronics; MPN: LQW18AN47NG00D; Datasheet: https://search.murata.co.jp/Ceramy/image/img/P02/JELF243A-0024.pdf; LCSC: C98076
Q4 = AO3400A: MOSFET (N-Channel); Manufacturer_Name: Alpha & Omega Semiconductors; Datasheet Link: http://aosmd.com/res/data_sheets/AO3400A.pdf; Height: 1.25mm; Manufacturer_Part_Number: AO3400A; Arrow Part Number: AO3400A; Arrow Price/Stock: https://www.arrow.com/en/products/ao3400a/alpha-and-omega-semiconductor?region=nac
R85 = QR0603J10R0P05Z: 100mW Thick Film Resistors 75V ±5% ±100ppm/℃ -55℃~+155℃ 10Ω 0603 Chip Resistor - Surface Mount ROHS; Manufacturer: Ever Ohms Tech; Datasheet: https://datasheet.lcsc.com/lcsc/2304140030_Ever-Ohms-Tech-QR0603J10R0P05Z_C176153.pdf; LCSC: C176153; MPN: QR0603J10R0P05Z
R86 = AC0603FR-13100RL: as R59 on sheet 3.4_4.2V_TO_FIXED_3.3V; Min Operating Temp: -55; Max Operating Temp: +155; Type: *; MPN: AC0603FR-13100RL; Datasheet: https://datasheet.lcsc.com/lcsc/2201180400_YAGEO-AC0603FR-13100RL_C1512172.pdf; LCSC: C1512172
R88 = 0603WAF1002T5E: as R80 on sheet STM32F446RET6; Max Operating Temp: 155℃; Min Operating Temp: -55℃; MPN: 0603WAF1002T5E; Datasheet: https://datasheet.lcsc.com/szlcsc/Uniroyal-Elec-0603WAF1002T5E_C25804.pdf; LCSC: C25804; Value: 10K,75V,1%
U21 = TXS0102DCUR: 2-Bit Bidirectional Voltage-Level Shifter for Open-Drain and Push-Pull Application 8-VSSOP -40 to 85; Manufacturer: Texas Instruments; Value: 2 Channel 24Mbps; MPN: TXS0102DCUR; Datasheet: https://www.ti.com/general/docs/suppproductinfo.tsp?distId=10&gotoUrl=https%3A%2F%2Fwww.ti.com%2Flit%2Fgpn%2Ftxs0102; LCSC: C53434; Package: VSSOP-8 Texas Instruments
U22 = SIM7600G: SMD,30x30mm 2G/3G/4G/5G Modules ROHS; Manufacturer: SIMCOM; LCSC: C5354753; MPN: SIM7600G; Package: SMD,30x30mm; Datasheet: https://atta.szlcsc.com/upload/public/pdf/source/20231229/240E3B9F5EAC246FE328D39ABFB18210.pdf